# Altium project radxa_cm3i_io_board_v1.4.PrjPcb (part 3 of 4)

## Sheet 16.SchDoc
size 420 x 297 mm
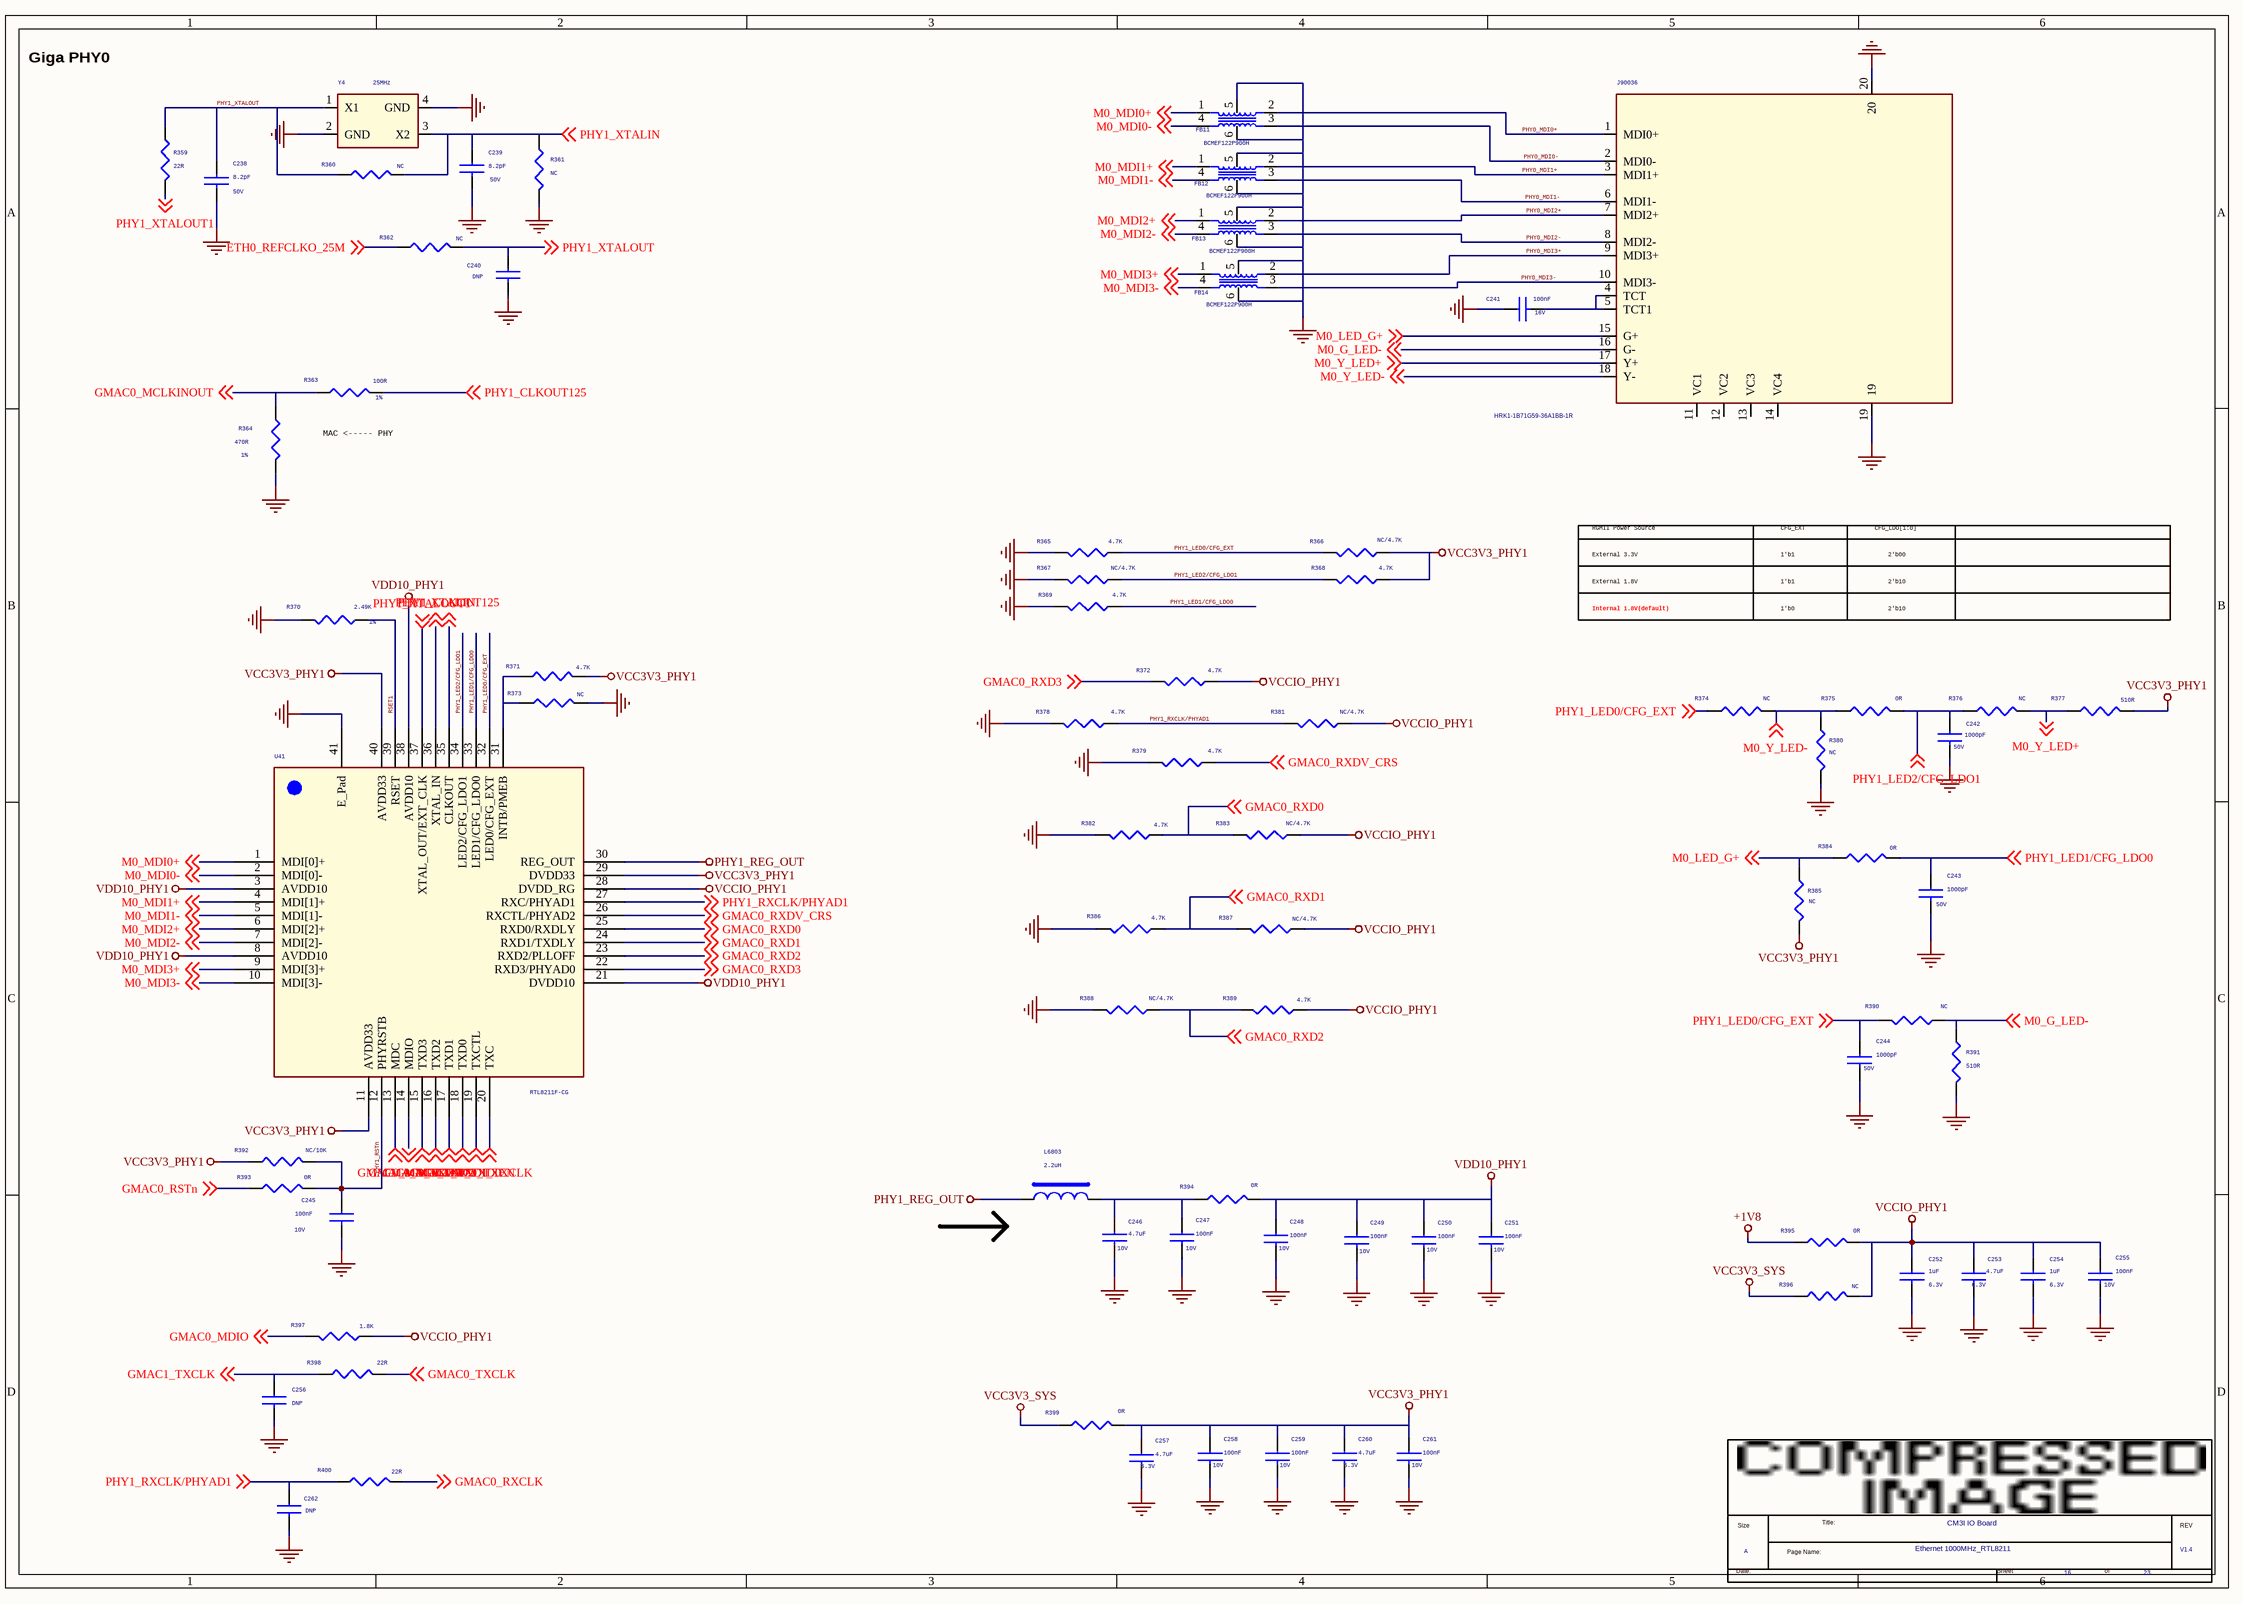
[diagram p14: 16.SchDoc]

### Parts
(Parts that share a designator on the sheet are numbered #1, #2 ... from top to bottom, then left to right.)
*#15  Page Count: 23  Page Number: 16  Page Size: A  Title: CM3I IO Board  RevCode: V1.4  Doc: Ethernet 1000MHz_RTL8211  (hidden comment: radxa_1010)  (graphical)
C238  8.2pF  Voltage: 50V  [C0402]
C239  8.2pF  Voltage: 50V  [C0402]
C240  DNP  [C0402]
C241  100nF  Voltage: 16V  [C0402]
C242  1000pF  Voltage: 50V  [C0402]
C243  1000pF  Voltage: 50V  [C0402]
C244  1000pF  Voltage: 50V  [C0402]
C245  100nF  Voltage: 10V  [C0402]
C246  4.7uF  Voltage: 10V  [C0603]
C247  100nF  Voltage: 10V  [C0402]
C248  100nF  Voltage: 10V  [C0402]
C249  100nF  Voltage: 10V  [C0402]
C250  100nF  Voltage: 10V  [C0402]
C251  100nF  Voltage: 10V  [C0402]
C252  1uF  Voltage: 6.3V  [C0402]
C253  4.7uF  Voltage: 6.3V  [C0402]
C254  1uF  Voltage: 6.3V  [C0402]
C255  100nF  Voltage: 10V  [C0402]
C256  DNP  [C0402]
C257  4.7uF  Voltage: 6.3V  [C0402]
C258  100nF  Voltage: 10V  [C0402]
C259  100nF  Voltage: 10V  [C0402]
C260  4.7uF  Voltage: 6.3V  [C0402]
C261  100nF  Voltage: 10V  [C0402]
C262  DNP  [C0402]
FB11  BCMEF122P900H  [GMDG-6PIN_ESD]
FB12  BCMEF122P900H  [GMDG-6PIN_ESD]
FB13  BCMEF122P900H  [GMDG-6PIN_ESD]
FB14  BCMEF122P900H  [GMDG-6PIN_ESD]
J90036  HRK1-1B71G59-36A1BB-1R  [RJ45_PULSE]
L6803  2.2uH  [IND_252010]
R359  22R  [R0402]
R360  NC  [R0402]
R361  NC  [R0402]
R362  NC  [R0402]
R363  100R  Tolerance: 1%  [R0402]
R364  470R  Tolerance: 1%  [R0402]
R365  4.7K  [R0402]
R366  NC/4.7K  [R0402]
R367  NC/4.7K  [R0402]
R368  4.7K  [R0402]
R369  4.7K  [R0402]
R370  2.49K  Tolerance: 1%  [R0402]
R371  4.7K  [R0402]
R372  4.7K  [R0402]
R373  NC  [R0402]
R374  NC  [R0402]
R375  0R  [R0402]
R376  NC  [R0402]
R377  510R  [R0402]
R378  4.7K  [R0402]
R379  4.7K  [R0402]
R380  NC  [R0402]
R381  NC/4.7K  [R0402]
R382  4.7K  [R0402]
R383  NC/4.7K  [R0402]
R384  0R  [R0402]
R385  NC  [R0402]
R386  4.7K  [R0402]
R387  NC/4.7K  [R0402]
R388  NC/4.7K  [R0402]
R389  4.7K  [R0402]
R390  NC  [R0402]
R391  510R  [R0402]
R392  NC/10K  [R0402]
R393  0R  [R0402]
R394  0R  [R0402]
R395  0R  [R0402]
R396  NC  [R0402]
R397  1.8K  [R0402]
R398  22R  [R0402]
R399  0R  [R0402]
R400  22R  [R0402]
U41  RTL8211F-CG  [QFN40_5R00X5R00X0R80_T]
Y4  25MHz  [CRY-3225]

### Nets
+1V8: R395.1
GND: C238.2 C239.2 C240.2 C241.1 C242.2 C243.2 C244.2 C245.2 C246.2 C247.2 C248.2 C249.2 C250.2 C251.2 C252.2 C253.2 C254.2 C255.2 C256.2 C257.2 C258.2 C259.2 C260.2 C261.2 C262.2 FB11.5 FB11.6 FB12.5 FB12.6 FB13.5 FB13.6 FB14.5 FB14.6 J90036.19 J90036.20 R361.2 R364.2 R365.2 R367.2 R369.2 R370.2 R373.2 R378.2 R379.2 R380.2 R382.2 R386.2 R388.2 R391.2 U41.41(E_Pad) Y4.2(GND) Y4.4(GND)
PHY1_REG_OUT: L6803.1 U41.30(REG_OUT)
VCC3V3_PHY1: C257.1 C258.1 C259.1 C260.1 C261.1 R366.1 R368.1 R371.2 R377.2 R385.2 R392.1 R399.2 U41.11(AVDD33) U41.29(DVDD33) U41.40(AVDD33)
VCC3V3_SYS: R396.1 R399.1
VCCIO_PHY1: C252.1 C253.1 C254.1 C255.1 R372.1 R381.1 R383.1 R387.1 R389.1 R395.2 R396.2 R397.1 U41.28(DVDD_RG)
VDD10_PHY1: C248.1 C249.1 C250.1 C251.1 R394.2 U41.3(AVDD10) U41.8(AVDD10) U41.21(DVDD10) U41.38(AVDD10)
ETH0_REFCLKO_25M: R362.1 ; off-sheet ETH0_REFCLKO_25M
GMAC0_MCLKINOUT: R363.1 R364.1 ; off-sheet GMAC0_MCLKINOUT
GMAC0_MDC: U41.13(MDC) ; off-sheet GMAC0_MDC
GMAC0_MDIO: R397.2 U41.14(MDIO) ; off-sheet GMAC0_MDIO
GMAC0_RSTn: R393.1 ; off-sheet GMAC0_RSTn
GMAC0_RXCLK: R400.2 ; off-sheet GMAC0_RXCLK
GMAC0_RXD0: R382.1 R383.2 U41.25(RXD0/RXDLY) ; off-sheet GMAC0_RXD0
GMAC0_RXD1: R386.1 R387.2 U41.24(RXD1/TXDLY) ; off-sheet GMAC0_RXD1
GMAC0_RXD2: R388.1 R389.2 U41.23(RXD2/PLLOFF) ; off-sheet GMAC0_RXD2
GMAC0_RXD3: R372.2 U41.22(RXD3/PHYAD0) ; off-sheet GMAC0_RXD3
GMAC0_RXDV_CRS: R379.1 U41.26(RXCTL/PHYAD2) ; off-sheet GMAC0_RXDV_CRS
GMAC0_TXCLK: R398.2 ; off-sheet GMAC0_TXCLK
GMAC0_TXD0: U41.18(TXD0) ; off-sheet GMAC0_TXD0
GMAC0_TXD1: U41.17(TXD1) ; off-sheet GMAC0_TXD1
GMAC0_TXD2: U41.16(TXD2) ; off-sheet GMAC0_TXD2
GMAC0_TXD3: U41.15(TXD3) ; off-sheet GMAC0_TXD3
GMAC0_TXEN: U41.19(TXCTL) ; off-sheet GMAC0_TXEN
GMAC1_TXCLK: C256.1 R398.1 U41.20(TXC) ; off-sheet GMAC1_TXCLK
M0_G_LED-: J90036.16(G-) R390.1 R391.1 ; off-sheet M0_G_LED-
M0_LED_G+: J90036.15(G+) R384.1 R385.1 ; off-sheet M0_LED_G+
M0_MDI0+: FB11.1(R1) U41.1(MDI[0]+) ; off-sheet M0_MDI0+
M0_MDI0-: FB11.4(R2) U41.2(MDI[0]-) ; off-sheet M0_MDI0-
M0_MDI1+: FB12.1(R1) U41.4(MDI[1]+) ; off-sheet M0_MDI1+
M0_MDI1-: FB12.4(R2) U41.5(MDI[1]-) ; off-sheet M0_MDI1-
M0_MDI2+: FB13.1(R1) U41.6(MDI[2]+) ; off-sheet M0_MDI2+
M0_MDI2-: FB13.4(R2) U41.7(MDI[2]-) ; off-sheet M0_MDI2-
M0_MDI3+: FB14.1(R1) U41.9(MDI[3]+) ; off-sheet M0_MDI3+
M0_MDI3-: FB14.4(R2) U41.10(MDI[3]-) ; off-sheet M0_MDI3-
M0_Y_LED+: J90036.17(Y+) R376.2 R377.1 ; off-sheet M0_Y_LED+
M0_Y_LED-: J90036.18(Y-) R374.1 R375.1 R380.1 ; off-sheet M0_Y_LED-
PHY0_MDI0+: FB11.2(R4) J90036.1(MDI0+)
PHY0_MDI0-: FB11.3(R3) J90036.2(MDI0-)
PHY0_MDI1+: FB12.2(R4) J90036.3(MDI1+)
PHY0_MDI1-: FB12.3(R3) J90036.6(MDI1-)
PHY0_MDI2+: FB13.2(R4) J90036.7(MDI2+)
PHY0_MDI2-: FB13.3(R3) J90036.8(MDI2-)
PHY0_MDI3+: FB14.2(R4) J90036.9(MDI3+)
PHY0_MDI3-: FB14.3(R3) J90036.10(MDI3-)
PHY1_CLKOUT125: R363.2 U41.35(CLKOUT) ; off-sheet PHY1_CLKOUT125
PHY1_LED0/CFG_EXT: C244.1 R365.1 R366.2 R374.2 R390.2 U41.32(LED0/CFG_EXT) ; off-sheet PHY1_LED0/CFG_EXT
PHY1_LED1/CFG_LDO0: C243.1 R369.1 R384.2 U41.33(LED1/CFG_LDO0) ; off-sheet PHY1_LED1/CFG_LDO0
PHY1_LED2/CFG_LDO1: C242.1 R367.1 R368.2 R375.2 R376.1 U41.34(LED2/CFG_LDO1) ; off-sheet PHY1_LED2/CFG_LDO1
PHY1_RSTn: C245.1 R392.2 R393.2 U41.12(PHYRSTB)
PHY1_RXCLK/PHYAD1: C262.1 R378.1 R381.2 R400.1 U41.27(RXC/PHYAD1) ; off-sheet PHY1_RXCLK/PHYAD1
PHY1_XTALIN: C239.1 R360.2 R361.1 U41.36(XTAL_IN) Y4.3(X2) ; off-sheet PHY1_XTALIN
PHY1_XTALOUT: C238.1 C240.1 R359.1 R360.1 R362.2 Y4.1(X1) ; off-sheet PHY1_XTALOUT
PHY1_XTALOUT1: R359.2 U41.37(XTAL_OUT/EXT_CLK) ; off-sheet PHY1_XTALOUT1
RSET1: R370.1 U41.39(RSET)
NetC241_2: C241.2 J90036.4(TCT) J90036.5(TCT1)
NetC246_1: C246.1 C247.1 L6803.2 R394.1
NetR371_1: R371.1 R373.1 U41.31(INTB/PMEB)

Not connected (* = marked no-connect by the designer): J90036 11(VC1) 12(VC2) 13(VC3) 14(VC4)

### Notes on the sheet
- Giga PHY0
- MAC <----- PHY
- RGMII Power Source
- CFG_EXT
- CFG_LDO[1:0]
- External 3.3V
- External 1.8V
- 1'b1
- 2'b00
- 2'b10
- Internal 1.8V(default)
- 1'b0
- (in symbol radxa_1010) Size; Title:; REV; Page Name:; Date:; Sheet; of

### Library data of the parts
C238 C239 = CAP NP_0_Dup4: cap,18.00pF,+/-5%,50V,C0G,C0402; Manufacturer PN: C1005C0G1H180J050BA; Manufacturer: TDK; Tolerance: 5%; Priority: A; Dielectric: C0G; Created by: JJJ; Part Type: C0402; RK PN: C1005C0G1H180J050BA
C240 C256 = CAP NP_0_Dup4: Did Not Place.; Number: 37; RK PN: DNPC0402; Priority: A; C_Voltage: 6.3V; Part Type: DNP; Manufacturer PN: DNPC0402; Created by: JJJ
C241 = CAP NP_0_Dup4: cap,100.00nF,+/-10%,16V,X5R,C0402; Manufacturer: TDK; RK PN: C1005X5R1C104K050BA; Priority: A; Tolerance: 10%; Dielectric: X5R; Part Type: C0402; Manufacturer PN: C1005X5R1C104K050BA; Created by: JJJ
C242-C244 = CAP NP_0_Dup4: cap,100.00pF,+/-10%,50V,C0G,C0402; Manufacturer: TDK; Number: 37; RK PN: C1005C0G1H101K050BA; Priority: A; Tolerance: 10%; C_Voltage: 6.3V; option: DNP; Dielectric: C0G; Part Type: C0402; Manufacturer PN: C1005C0G1H101K050BA; Created by: JJJ
C245 = CAP NP_0_Dup4: cap,100.00nF,+/-10%,10V,X5R,C0402; Manufacturer PN: C1005X5R1A104K050BA; Manufacturer: TDK; Tolerance: 10%; Priority: A; Dielectric: X5R; Created by: JJJ; Part Type: C0402; RK PN: C1005X5R1A104K050BA
C246 = CAP NP_0_Dup4: cap,4.70uF,+/-10%,10V,X5R,C0603; Manufacturer: TDK; RK PN: C1608X5R1A475K080AC; Priority: A; C_Voltage: 6.3V; Tolerance: 10%; Dielectric: X5R; Part Type: C0603; Manufacturer PN: C1608X5R1A475K080AC; Created by: JJJ
C247 C249-C251 C255 C258 C259 C261 = CAP NP_0_Dup4: cap,100.00nF,+/-10%,10V,X5R,C0402; Manufacturer PN: C1005X5R1A104K050BA; Manufacturer: TDK; C_Voltage: 6.3V; Tolerance: 10%; Priority: A; Number: 37; Dielectric: X5R; Created by: JJJ; Part Type: C0402; RK PN: C1005X5R1A104K050BA
C248 = CAP NP_0_Dup4: cap,100.00nF,+/-10%,10V,X5R,C0402; Manufacturer: TDK; Number: 37; RK PN: C1005X5R1A104K050BA; Priority: A; Tolerance: 10%; C_Voltage: 6.3V; Dielectric: X5R; Part Type: C0402; Manufacturer PN: C1005X5R1A104K050BA; Created by: JJJ
C252 C254 = CAP NP_0_Dup4: cap,1.00uF,+/-10%,6.3V,X5R,C0402; Manufacturer PN: C1005X5R0J105K050BB; Manufacturer: TDK; Tolerance: 10%; Priority: A; Dielectric: X5R; Created by: JJJ; C_Voltage: 6.3V; Part Type: C0402; RK PN: C1005X5R0J105K050BB
C253 C257 = CAP NP_0_Dup4: cap,4.70uF,+/-10%,6.3V,X5R,C0402; Manufacturer PN: C1005X5R0J475K050BC; Manufacturer: TDK; Tolerance: 10%; Priority: A; Dielectric: X5R; Created by: JJJ; C_Voltage: 6.3V; Part Type: C0402; RK PN: C1005X5R0J475K050BC
C260 = CAP NP_0_Dup4: cap,4.70uF,+/-10%,6.3V,X5R,C0402; Manufacturer: TDK; RK PN: C1005X5R0J475K050BC; Priority: A; Tolerance: 10%; Dielectric: X5R; Part Type: C0402; C_Voltage: 6.3V; Manufacturer PN: C1005X5R0J475K050BC; Created by: JJJ
C262 = CAP NP_0_Dup4: Did Not Place.; Manufacturer PN: DNPC0402; C_Voltage: 6.3V; Priority: A; Number: 37; Created by: JJJ; Part Type: DNP; RK PN: DNPC0402
FB11-FB14 = R-PACK4_0_Dup1
J90036 = HR911130C_1: 千兆网口接口，内置变压器; VAL: J00-0061; DESIG: 10/100 base TX LXT971A; BOI: RJ45; FAB: PULSE; DEV: CON_PULSE_J00-61; Priority: A; REF: J00-0061; RK PN: HR911130C; Part Type: Ethernet Jack; Manufacturer Part Number: HR911130C; Created by: JJJ
L6803 = INDUCTORS OF FERRITE_Dup1: Power Inductor,2.2uH,0.3,IND_303015; Manufacturer: sunlord; DC Resistor: 0.06ohm; Isat: 1.6A; RK PN: SWPA3015S2R2NT; Priority: A; Tolerance: 30%; Resonace frequency: 86M; Part Type: POWER_IND; Irms: 1.6A; Manufacturer PN: SWPA3015S2R2NT; Created by: YTL
R359 R361 = RESISTOR_0_Dup5: 通用厚膜电阻,0R,+/-5%,R0402,1/16W.; Manufacturer PN: RC0402JR-070RL; Manufacturer: YAGEO; Tolerance: 5%; option: DNP; Wattage: 1/16W; Priority: A; Created by: YTL; Part Type: 通用厚膜电阻; RK PN: RC0402JR-070RL
R360 = RESISTOR_0_Dup5: 通用厚膜电阻,0R,+/-5%,R0402,1/16W.; Manufacturer PN: RC0402JR-070RL; Manufacturer: YAGEO; Tolerance: 5%; Wattage: 1/16W; Priority: A; Option: DNP; Created by: YTL; Part Type: 通用厚膜电阻; RK PN: RC0402JR-070RL
R362 = RESISTOR_0_Dup5: 通用厚膜电阻,0R,+/-5%,R0402,1/16W.; Manufacturer: YAGEO; Tolerance: 5%; Option: DNP; RK PN: RC0402JR-070RL; Priority: A; Wattage: 1/16W; Part Type: 通用厚膜电阻; Manufacturer PN: RC0402JR-070RL; Created by: YTL
R363 = RESISTOR_0_Dup5: 通用厚膜电阻,100R,+/-5%,R0402,1/16W.; Manufacturer: YAGEO; RK PN: RC0402JR-07100RL; Priority: A; Wattage: 1/16W; Part Type: 通用厚膜电阻; Manufacturer PN: RC0402JR-07100RL; Created by: YTL
R364 = RESISTOR_0_Dup5: 通用厚膜电阻,120R,+/-5%,R0402,1/16W.; Manufacturer PN: RC0402JR-07120RL; Manufacturer: YAGEO; Wattage: 1/16W; Priority: A; Created by: YTL; Part Type: 通用厚膜电阻; RK PN: RC0402JR-07120RL
R365 R379 = RESISTOR_0_Dup5: 通用厚膜电阻,4K7,+/-5%,R0402,1/16W.; Manufacturer PN: RC0402JR-074K7L; Manufacturer: YAGEO; Tolerance: 5%; Wattage: 1/16W; Priority: A; Created by: YTL; Part Type: 通用厚膜电阻; RK PN: RC0402JR-074K7L
R366 = RESISTOR_0_Dup5: 通用厚膜电阻,4K7,+/-5%,R0402,1/16W.; Manufacturer PN: RC0402JR-074K7L; Manufacturer: YAGEO; Tolerance: 5%; Wattage: 1/16W; Priority: A; option: DNP; Created by: YTL; Part Type: 通用厚膜电阻; RK PN: RC0402JR-074K7L
R367 R381 R387 R388 = RESISTOR_0_Dup5: 通用厚膜电阻,4K7,+/-5%,R0402,1/16W.; Manufacturer: YAGEO; Tolerance: 5%; RK PN: RC0402JR-074K7L; Priority: A; Wattage: 1/16W; option: DNP; Part Type: 通用厚膜电阻; Manufacturer PN: RC0402JR-074K7L; Created by: YTL
R368 R369 R372 R378 R382 R386 R389 = RESISTOR_0_Dup5: 通用厚膜电阻,4K7,+/-5%,R0402,1/16W.; Manufacturer: YAGEO; Tolerance: 5%; RK PN: RC0402JR-074K7L; Priority: A; Wattage: 1/16W; Part Type: 通用厚膜电阻; Manufacturer PN: RC0402JR-074K7L; Created by: YTL
R370 = RESISTOR_0_Dup5: 通用厚膜电阻,2K49,+/-1%,R0402,1/16W.; Manufacturer PN: RC0402FR-072K49L; Manufacturer: YAGEO; Wattage: 1/16W; Priority: A; Created by: YTL; Part Type: 通用厚膜电阻; RK PN: RC0402FR-072K49L
R371 R374 R380 R393 = RESISTOR_0_Dup5: 通用厚膜电阻,0R,+/-5%,R0402,1/16W.; Manufacturer: YAGEO; Tolerance: 5%; RK PN: RC0402JR-070RL; Priority: A; Wattage: 1/16W; Part Type: 通用厚膜电阻; Manufacturer PN: RC0402JR-070RL; Created by: YTL
R373 R375 R399 = RESISTOR_0_Dup5: 通用厚膜电阻,0R,+/-5%,R0402,1/16W.; Manufacturer PN: RC0402JR-070RL; Manufacturer: YAGEO; Tolerance: 5%; Wattage: 1/16W; Priority: A; Created by: YTL; Part Type: 通用厚膜电阻; RK PN: RC0402JR-070RL
R376 = RESISTOR_0_Dup5: 通用厚膜电阻,0R,+/-5%,R0402,1/16W.; Manufacturer: YAGEO; Tolerance: 5%; RK PN: RC0402JR-070RL; Priority: A; Wattage: 1/16W; option: DNP; Part Type: 通用厚膜电阻; Manufacturer PN: RC0402JR-070RL; Created by: YTL
R377 R390 R391 = RESISTOR_0_Dup5: 通用厚膜电阻,510R,+/-5%,R0402,1/16W.; Manufacturer: YAGEO; Tolerance: 5%; RK PN: RC0402JR-07510RL; Priority: A; Wattage: 1/16W; Part Type: 通用厚膜电阻; Manufacturer PN: RC0402JR-07510RL; Created by: YTL
R383 = RESISTOR_0_Dup5: 通用厚膜电阻,4K7,+/-5%,R0402,1/16W.; Manufacturer PN: RC0402JR-074K7L; Manufacturer: YAGEO; Tolerance: 5%; option: DNP; Wattage: 1/16W; Priority: A; Created by: YTL; Part Type: 通用厚膜电阻; RK PN: RC0402JR-074K7L
R384 = RESISTOR_0_Dup5: 通用厚膜电阻,120R,+/-5%,R0402,1/16W.; Manufacturer PN: RC0402JR-07120RL; Manufacturer: YAGEO; Tolerance: 5%; Wattage: 1/16W; Priority: A; Created by: YTL; Part Type: 通用厚膜电阻; RK PN: RC0402JR-07120RL
R385 = RESISTOR_0_Dup5: 通用厚膜电阻,510R,+/-5%,R0402,1/16W.; Manufacturer PN: RC0402JR-07510RL; Manufacturer: YAGEO; Tolerance: 5%; Wattage: 1/16W; Priority: A; Created by: YTL; Part Type: 通用厚膜电阻; RK PN: RC0402JR-07510RL
R392 = RESISTOR_0_Dup5: 通用厚膜电阻,10K,+/-5%,R0402,1/16W.; Manufacturer: YAGEO; Tolerance: 5%; RK PN: RC0402JR-0710KL; Priority: A; Wattage: 1/16W; Option: DNP; Part Type: 通用厚膜电阻; Manufacturer PN: RC0402JR-0710KL; Created by: YTL
R394 = RESISTOR_0_Dup5: 通用厚膜电阻,0R,+/-5%,R0402,1/16W.; Manufacturer PN: RC0402JR-070RL; Manufacturer: YAGEO; Tolerance: 5%; Wattage: 1/16W; Priority: A; option: DNP; Created by: YTL; Part Type: 通用厚膜电阻; RK PN: RC0402JR-070RL
R395 R396 = RESISTOR_0_Dup5: 通用厚膜电阻,0R,+/-5%,R0402,1/16W.; Manufacturer: YAGEO; Tolerance: 5%; option: DNP; RK PN: RC0402JR-070RL; Priority: A; Wattage: 1/16W; Part Type: 通用厚膜电阻; Manufacturer PN: RC0402JR-070RL; Created by: YTL
R397 = RESISTOR_0_Dup5: 通用厚膜电阻,1K8,+/-5%,R0402,1/16W.; Manufacturer PN: RC0402JR-071K8L; Manufacturer: YAGEO; Tolerance: 5%; Wattage: 1/16W; Priority: A; Created by: YTL; Part Type: 通用厚膜电阻; RK PN: RC0402JR-071K8L
R398 R400 = RESISTOR_0_Dup5: 通用厚膜电阻,22R,+/-5%,R0402,1/16W.; Manufacturer: YAGEO; Tolerance: 5%; RK PN: RC0402JR-0722RL; Priority: A; Wattage: 1/16W; Part Type: 通用厚膜电阻; Manufacturer PN: RC0402JR-0722RL; Created by: YTL
U41 = Ethernet_RTL8211F: Integrated 10/100/1000 Gigabit Ethernet Transceiver，Supports IEEE 802.3az-2010,; Manufacturer: RealTek(瑞昱); Priority: A; Created by: JJJ; Manufacturer PN: RTL8211F-CG; Part Type: Ethernet; RK PN: RTL8211F-CG
Y4 = CRYSTAL_4P: 无源晶振，25M，3225,±10ppm，10pF，Hosonic; Manufacturer PN: E3SB25.0000F10E11; Manufacturer: Hosonic(鸿星电子); Priority: A; Created by: JJJ; Part Type: CRYSTAL; RK PN: E3SB25.0000F10E11
*#15 = radxa_1010: Page Create Date: March  8, 1995

## Sheet 17.SchDoc
size 297 x 209 mm
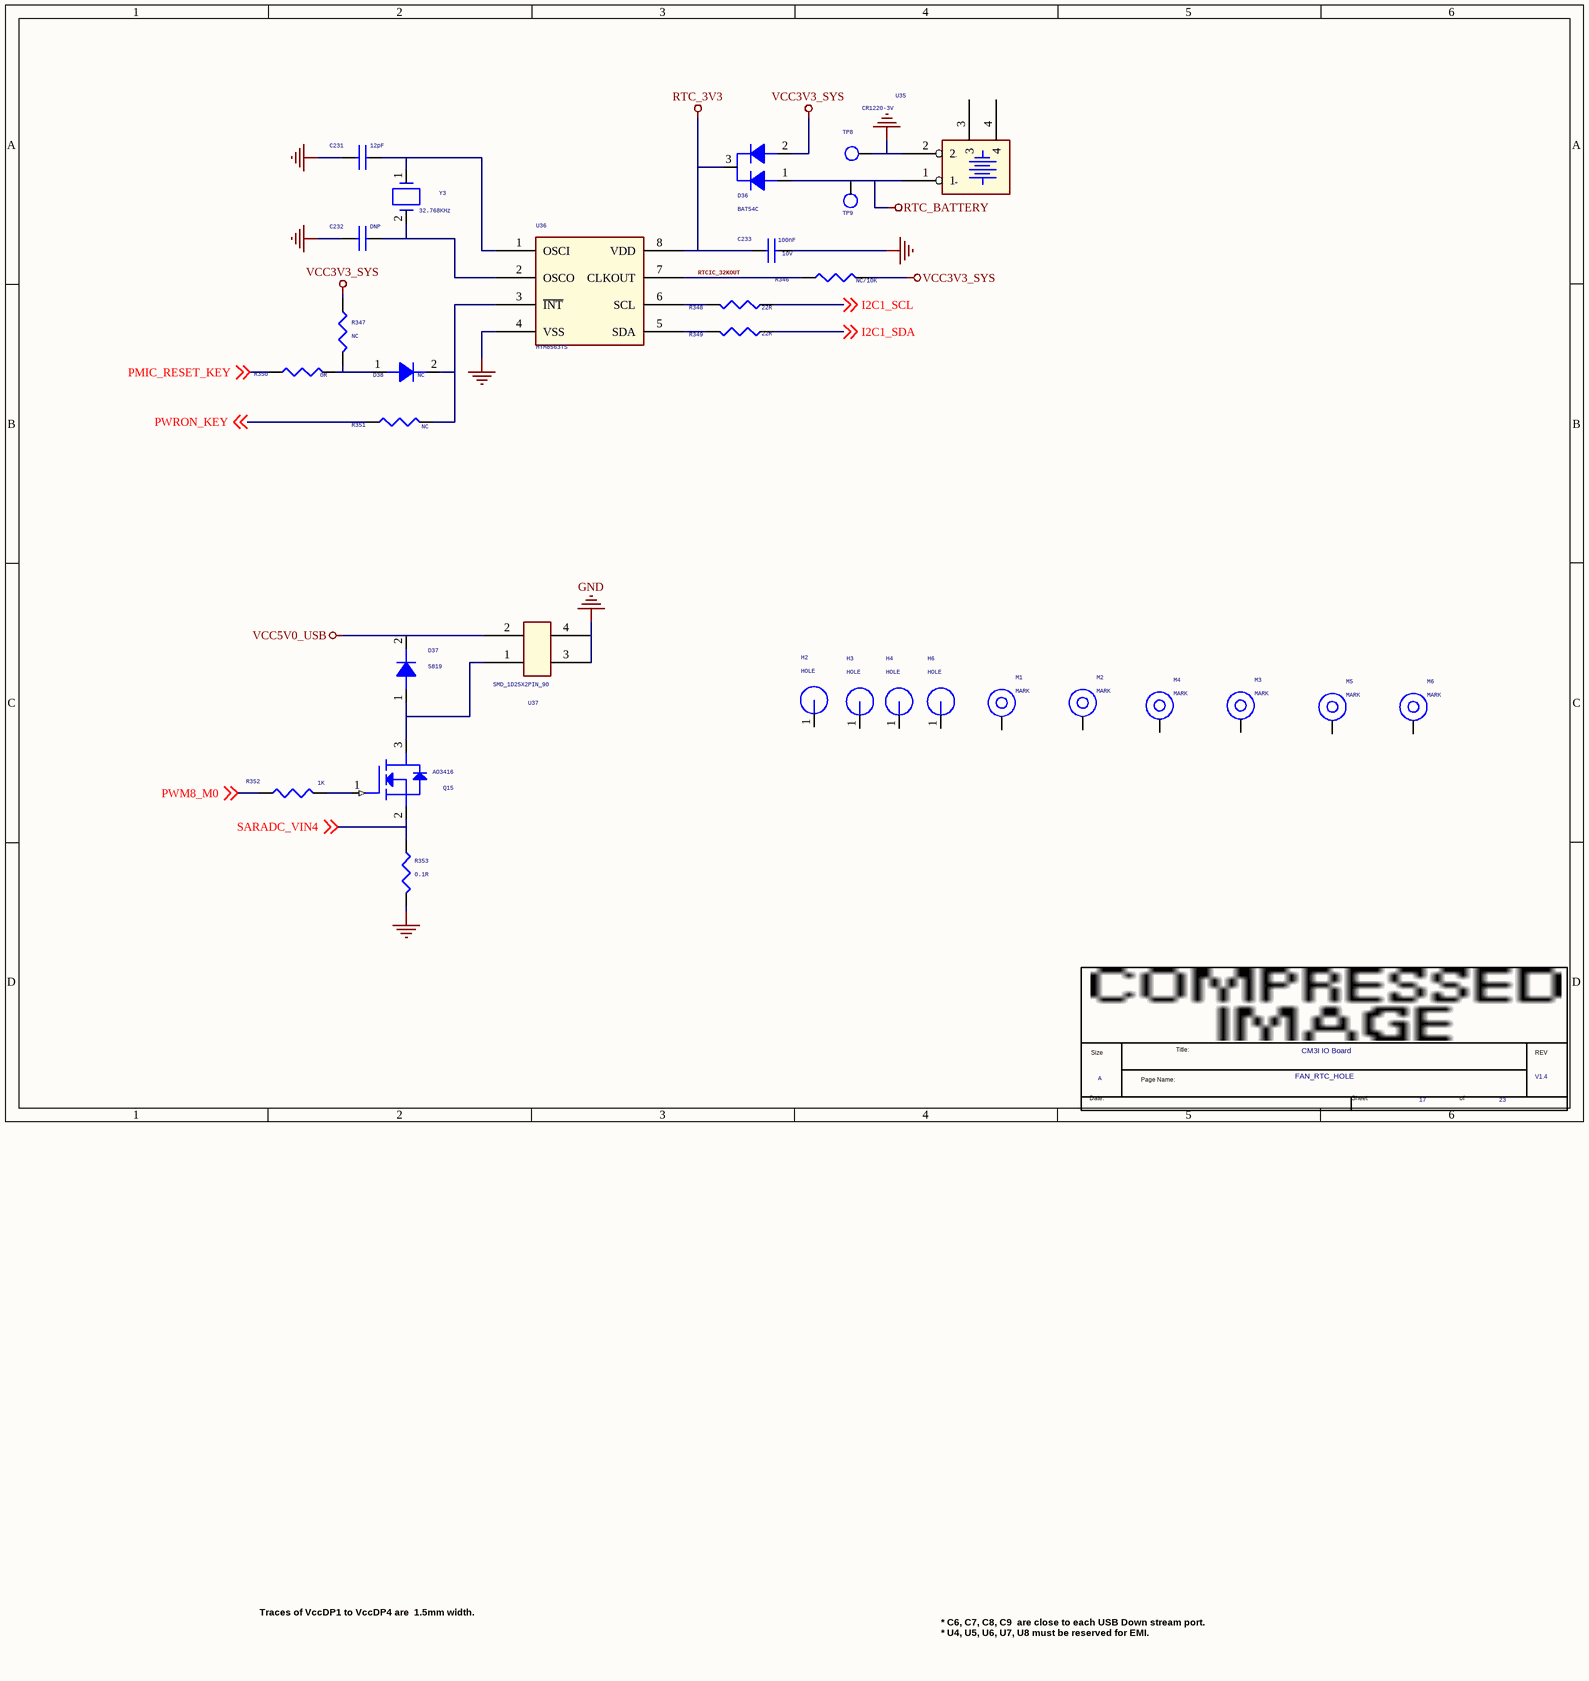
[diagram p15: 17.SchDoc]

### Parts
(Parts that share a designator on the sheet are numbered #1, #2 ... from top to bottom, then left to right.)
*#16  Page Count: 23  Page Number: 17  Page Size: A  Title: CM3I IO Board  RevCode: V1.4  Doc: FAN_RTC_HOLE  (hidden comment: radxa_1010)  (graphical)
C231  12pF  [C0402]
C232  DNP  [C0402]
C233  100nF  Voltage: 10V  [C0402]
D36  BAT54C  [SOT_23]
D37  5819  [SOD_123]
D38  NC  [SOD323]
H2  HOLE  [H3.8MM]
H3  HOLE  [H3.8MM]
H4  HOLE  [H3.8MM]
H6  HOLE  [H3.8MM]
M1  MARK  [MARK]
M2  MARK  [MARK]
M3  MARK  [MARK]
M4  MARK  [MARK]
M5  MARK  [MARK]
M6  MARK  [MARK]
Q15  AO3416  [SOT23]
R346  NC/10K  [R0402]
R347  NC  [R0402]
R348  22R  [R0402]
R349  22R  [R0402]
R350  0R  [R0402]
R351  NC  [R0402]
R352  1K  [R0402]
R353  0.1R  [R0402]
TP8  TP_0.7  [TEST]  (value not drawn)
TP9  TP_0.7  [TEST]  (value not drawn)
U35  CR1220-3V  [BATTERY-20MM]
U36  HYM8563TS  [MSOP8]
U37  SMD_1D25X2PIN_90  [SMD_1D25X2PIN_90]
Y3  32.768KHz  [CRY-3215]

### Nets
GND: C231.2 C232.2 C233.2 R353.2 TP8.1 U35.2 U36.4(VSS) U37.3 U37.4
RTC_3V3: C233.1 D36.3(K) U36.8(VDD)
RTC_BATTERY: D36.1(A1) TP9.1 U35.1
VCC3V3_SYS: D36.2(A2) R346.2 R347.1
VCC5V0_USB: D37.2(K) U37.2
I2C1_SCL: R348.1 ; off-sheet I2C1_SCL
I2C1_SDA: R349.1 ; off-sheet I2C1_SDA
PMIC_RESET_KEY: R350.1 ; off-sheet PMIC_RESET_KEY
PWM8_M0: R352.1 ; off-sheet PWM8_M0
PWRON_KEY: R351.1 ; off-sheet PWRON_KEY
RTCIC_32KOUT: R346.1 U36.7(CLKOUT)
SARADC_VIN4: Q15.2(SOURCE) R353.1 ; off-sheet SARADC_VIN4
NetC231_1: C231.1 U36.1(OSCI) Y3.1
NetC232_1: C232.1 U36.2(OSCO) Y3.2
NetD37_1: D37.1(A) Q15.3(DRAIN) U37.1
NetD38_1: D38.1(A) R347.2 R350.2
NetD38_2: D38.2(K) R351.2 U36.3(~{INT})
NetQ15_1: Q15.1(GATE) R352.2
NetR348_2: R348.2 U36.6(SCL)
NetR349_2: R349.2 U36.5(SDA)

Not connected (* = marked no-connect by the designer): H2 1; H3 1; H4 1; H6 1; M1 1; M2 1; M3 1; M4 1; M5 1; M6 1; U35 3 4

### Notes on the sheet
- Traces of VccDP1 to VccDP4 are  1.5mm width.
- * C6, C7, C8, C9  are close to each USB Down stream port.
  * U4, U5, U6, U7, U8 must be reserved for EMI.
- (in symbol CON_BATTERY-20MM_0) -; +
- (in symbol radxa_1010) Title:; Size; REV; Page Name:; Date:; Sheet; of

### Library data of the parts
C231 = CAP NP_0: cap,12.00pF,+/-5%,50V,C0G,C0402; Manufacturer PN: C1005C0G1H120J050BA; Manufacturer: TDK; Tolerance: 5%; Priority: A; Voltage: 50V; Dielectric: C0G; Created by: JJJ; Part Type: C0402; RK PN: C1005C0G1H120J050BA
C232 = CAP NP_0: Did Not Place.; Manufacturer PN: DNPC0402; Priority: A; Created by: JJJ; Part Type: DNP; RK PN: DNPC0402
C233 = CAP NP_0: cap,100.00nF,+/-10%,10V,X5R,C0402; Manufacturer: TDK; Number: 37; RK PN: C1005X5R1A104K050BA; Priority: A; Tolerance: 10%; C_Voltage: 6.3V; Dielectric: X5R; Part Type: C0402; Manufacturer PN: C1005X5R1A104K050BA; Created by: JJJ
D36 = DIODE Double: Dual Schottky barrier，BAT54C SOT-23 Schottky Barrier; Manufacturer: 长电; Priority: A; Created by: JJJ; Manufacturer PN: BAT54C; Part Type: Schottky rectifier; RK PN: BAT54C
D37 D38 = DIODE_Dup2: Schottky Barrier，B5819WS SOD-323; Manufacturer: 长电; Priority: A; Created by: JJJ; Manufacturer PN: B5819WS; Part Type: Schottky rectifier; RK PN: B5819WS
H2 H3 H6 = HOLE: 直径3.5mm hole; Priority: A; RK PN: HOLE_3R50; Created by: CZD; Part Type: HOLE
H4 = HOLE: 直径3.5mm hole; RK PN: HOLE_3R50; Priority: A; Part Type: HOLE; Created by: CZD
M1 M3 = MARK: MARK Symble; Priority: A; RK PN: MARK01; Created by: JJJ; Part Type: MARK
M2 M4-M6 = MARK: MARK Symble; RK PN: MARK01; Priority: A; Part Type: MARK; Created by: JJJ
Q15 = MOSFET N_Dup1: MOSFET-N,WNM3003 ,30V,+/-20V,4.0A,33m Ohm@Vgs=10V,43m Ohm@Vgs=4.5V,SOT23
R346 R347 R350 = RESISTOR_0_Dup1: 通用厚膜电阻,10K,+/-5%,R0402,1/16W.; Manufacturer PN: RC0402JR-0710KL; Manufacturer: YAGEO; Tolerance: 5%; option: DNP; Wattage: 1/16W; Priority: A; Created by: YTL; Part Type: 通用厚膜电阻; RK PN: RC0402JR-0710KL
R348 = RESISTOR_0_Dup1: 通用厚膜电阻,47K,+/-5%,R0402,1/16W.; Manufacturer: YAGEO; Tolerance: 5%; RK PN: RC0402JR-0747KL; Priority: A; Wattage: 1/16W; Part Type: 通用厚膜电阻; Manufacturer PN: RC0402JR-0747KL; Created by: YTL
R349 = RESISTOR_0_Dup1: 通用厚膜电阻,47K,+/-5%,R0402,1/16W.; Manufacturer PN: RC0402JR-0747KL; Manufacturer: YAGEO; Tolerance: 5%; Wattage: 1/16W; Priority: A; Created by: YTL; Part Type: 通用厚膜电阻; RK PN: RC0402JR-0747KL
R351 = RESISTOR_0_Dup1: 通用厚膜电阻,10K,+/-5%,R0402,1/16W.; Manufacturer: YAGEO; Tolerance: 5%; RK PN: RC0402JR-0710KL; Priority: A; Wattage: 1/16W; option: DNP; Part Type: 通用厚膜电阻; Manufacturer PN: RC0402JR-0710KL; Created by: YTL
R352 = RESISTOR_0_Dup1: as R301 on sheet 11; Part Type: 通用厚膜电阻; Manufacturer PN: RC0402JR-07100KL; Created by: YTL
R353 = RESISTOR_0_Dup1: as R291 on sheet 11; Created by: YTL; Part Type: 通用厚膜电阻; RK PN: RC0402JR-0710KL
TP8 = TP: Test Point 0.7mm; RK PN: TESTPOINT_0R7; Priority: A; Part Type: TP; Created by: JJJ
TP9 = TP: Test Point 0.7mm; Priority: A; RK PN: TESTPOINT_0R7; Created by: JJJ; Part Type: TP
U35 = CON_BATTERY-20MM_0
U36 = RTC_HYM8563: I2C Real Time Clock/Calendar; Manufacturer: Haoyu（昊昱微电子）; Priority: A; Created by: JJJ; Manufacturer PN: HYM8563TS; Part Type: RTC; RK PN: HYM8563TS
U37 = CON3_6
Y3 = CRYSTAL_2P_0: 无源晶振，32.768KHz，MC-146,±20ppm，12.5pF，Hosonic; Manufacturer: Hosonic(鸿星电子); RK PN: ETDE32.768W125BMPF; Priority: A; Part Type: CRYSTAL; Manufacturer PN: ETDE32.768W125BMPF; Created by: JJJ
*#16 = radxa_1010: Page Create Date: March  8, 1995

## Sheet 18.SchDoc
size 297 x 209 mm
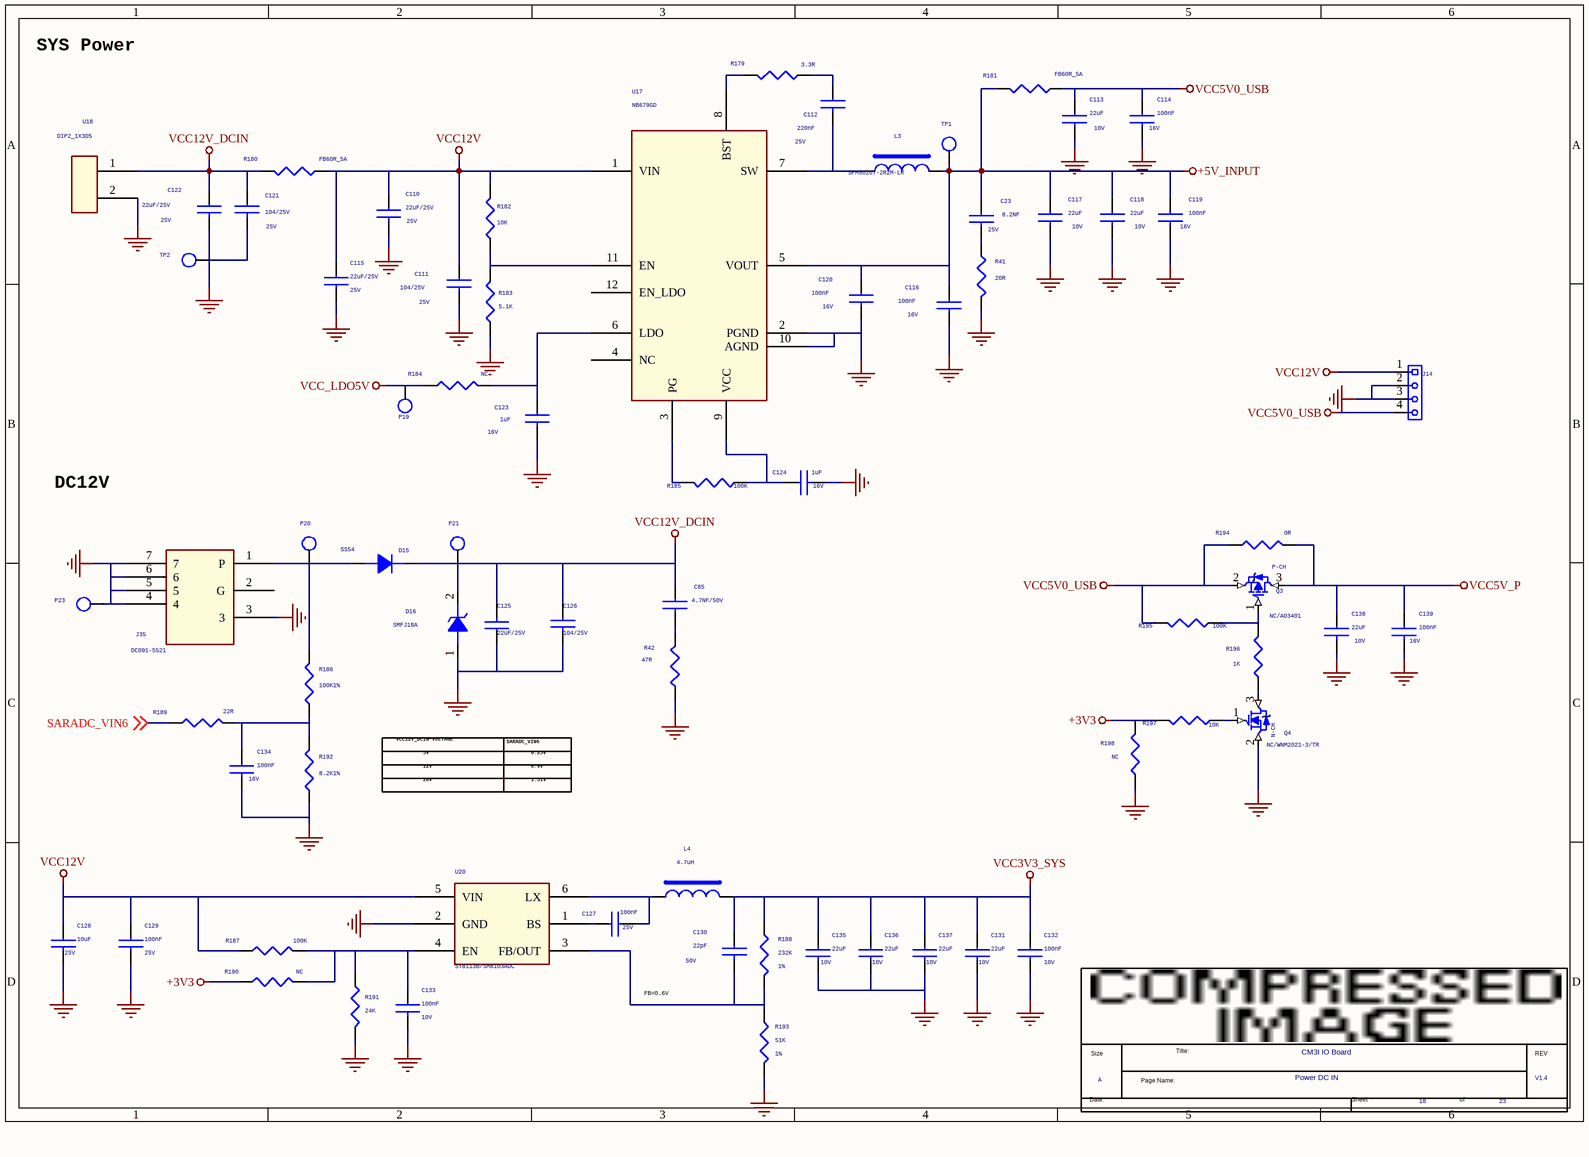
[diagram p16: 18.SchDoc]

### Parts
(Parts that share a designator on the sheet are numbered #1, #2 ... from top to bottom, then left to right.)
*#17  Page Count: 23  Page Number: 18  Page Size: A  Title: CM3I IO Board  RevCode: V1.4  Doc: Power DC IN  (hidden comment: radxa_1010)  (graphical)
C23  8.2NF  Voltage: 25V  [C0402]
C85  4.7NF/50V  [C0603]
C110  22uF/25V  Voltage: 25V  [C0805]
C111  104/25V  Voltage: 25V  [C0402]
C112  220nF  Voltage: 25V  [C0402]
C113  22uF  Voltage: 10V  [C0603]
C114  100nF  Voltage: 16V  [C0402]
C115  22uF/25V  Voltage: 25V  [C0805]
C116  100nF  Voltage: 16V  [C0402]
C117  22uF  Voltage: 10V  [C0603]
C118  22uF  Voltage: 10V  [C0603]
C119  100nF  Voltage: 16V  [C0402]
C120  100nF  Voltage: 16V  [C0402]
C121  104/25V  Voltage: 25V  [C0402]
C122  22uF/25V  Voltage: 25V  [C0805]
C123  1uF  Voltage: 16V  [C0402]
C124  1uF  Voltage: 16V  [C0402]
C125  22uF/25V  [C0805]
C126  104/25V  [C0402]
C127  100nF  Voltage: 25V  [C0402]
C128  10uF  Voltage: 25V  [C1206]
C129  100nF  Voltage: 25V  [C0402]
C130  22pF  Voltage: 50V  [C0402]
C131  22uF  Voltage: 10V  [C0805]
C132  100nF  Voltage: 10V  [C0402]
C133  100nF  Voltage: 10V  [C0402]
C134  100nF  Voltage: 16V  [C0402]
C135  22uF  Voltage: 10V  [C0805]
C136  22uF  Voltage: 10V  [C0805]
C137  22uF  Voltage: 10V  [C0805]
C138  22uF  Voltage: 10V  [C0603]
C139  100nF  Voltage: 16V  [C0402]
D15  SS54  [DO_214AC]
D16  SMFJ18A  [SOD_123]
J14  HEADER_1X4P  [header_1x4]  (value not drawn)
J35  DC091-5521  [DC091-5521]
L3  SPM5020T-2R2M-LR  [IND-5020]
L4  4.7uH  [IND-4X4]
P19  TEST  [TEST]  (value not drawn)
P20  TEST  [TEST]  (value not drawn)
P21  TEST  [TEST]  (value not drawn)
P23  TEST  [TEST]  (value not drawn)
Q3  NC/AO3401  [S0T-23]
Q4  NC/WNM2021-3/TR  [S0T-23]
R41  20R  [R0402]
R42  47R  [R0402]
R179  3.3R  [R0402]
R180  FB60R_5A  [R1206]
R181  FB60R_5A  [R1206]
R182  10K  [R0402]
R183  5.1K  [R0402]
R184  NC  [R0402]
R185  100K  [R0402]
R186  100K1%  [R0402]
R187  100K  [R0402]
R188  232K  Tolerance: 1%  [R0402]
R189  22R  [R0402]
R190  NC  [R0402]
R191  24K  [R0402]
R192  8.2K1%  [R0402]
R193  51K  Tolerance: 1%  [R0402]
R194  0R  [R0603]
R195  100K  [R0402]
R196  1K  [R0402]
R197  10K  [R0402]
R198  NC  [R0402]
TP1  TP_0.7  [TEST]  (value not drawn)
TP2  TP_0.7  [TEST]  (value not drawn)
U17  NB679GD  [QFN12_3R00X2R00X0R90]
U18  DIP2_1X3D5  [DIP2_1X3D5]
U20  SY8113B/SM8103ADC  [SOT_23_6]

### Nets
+3V3: R190.1 R197.2 R198.1
+5V_INPUT: C23.1 C116.1 C117.1 C118.1 C119.1 C120.1 L3.2 R181.2 TP1.1 U17.5(VOUT)
GND: C110.2 C111.2 C113.2 C114.2 C115.2 C116.2 C117.2 C118.2 C119.2 C120.2 C121.2 C122.2 C123.2 C124.2 C125.1 C126.2 C128.2 C129.2 C131.2 C132.2 C133.2 C134.2 C135.2 C136.2 C137.2 C138.2 C139.2 D16.1(ANODE) J14.2 J14.3 J35.3 J35.4 J35.5 J35.6 J35.7 P23.1 Q4.2(S) R41.2 R42.1 R183.1 R191.2 R192.1 R193.2 R198.2 TP2.1 U17.2(PGND) U17.10(AGND) U18.2 U20.2(GND)
VCC3V3_SYS: C130.1 C131.1 C132.1 C135.1 C136.1 C137.1 L4.2 R188.1
VCC5V0_USB: C113.1 C114.1 J14.4 Q3.2(S) R181.1 R194.2 R195.2
VCC5V_P: C138.1 C139.1 Q3.3(D) R194.1
VCC12V: C110.1 C111.1 C115.1 C128.1 C129.1 J14.1 R180.1 R182.2 R187.1 U17.1(VIN) U20.5(VIN)
VCC12V_DCIN: C85.1 C121.1 C122.1 C125.2 C126.1 D15.2(K) D16.2(CATHODE) P21.1 R180.2 U18.1
VCC_LDO5V: P19.1 R184.1
SARADC_VIN6: R189.1 ; off-sheet SARADC_VIN6
NetC23_2: C23.2 R41.1
NetC85_2: C85.2 R42.2
NetC112_1: C112.1 R179.2
NetC112_2: C112.2 L3.1 U17.7(SW)
NetC123_1: C123.1 R184.2 U17.6(LDO)
NetC124_1: C124.1 R185.2 U17.9(VCC)
NetC127_1: C127.1 U20.1(BS)
NetC127_2: C127.2 L4.1 U20.6(LX)
NetC130_2: C130.2 R188.2 R193.1 U20.3(FB/OUT)
NetC133_1: C133.1 R187.2 R190.2 R191.1 U20.4(EN)
NetC134_1: C134.1 R186.1 R189.2 R192.2
NetD15_1: D15.1(A) J35.1(P) P20.1 R186.2
NetQ3_1: Q3.1(G) R195.1 R196.1
NetQ4_1: Q4.1(G) R197.1
NetQ4_3: Q4.3(D) R196.2
NetR179_1: R179.1 U17.8(BST)
NetR182_1: R182.1 R183.2 U17.11(EN)
NetR185_1: R185.1 U17.3(PG)

Not connected (* = marked no-connect by the designer): J35 2(G); U17 4(NC) 12(EN_LDO)

### Notes on the sheet
- SYS Power
- DC12V
- VCC12V_DCIN-VOLTAGE
- SARADC_VIN6
- 5V
- 12V
- 20V
- 0.25V
- 1.51V
- 0.9V
- FB=0.6V
- (in symbol N-MOSFET) N-CH
- (in symbol P-MOSFET) P-CH
- (in symbol radxa_1010) Title:; Size; REV; Page Name:; Date:; Sheet; of

### Library data of the parts
C23 = CAP NP_0_Dup1: cap,100.00nF,+/-10%,16V,X5R,C0402; Manufacturer PN: C1005X5R1C104K050BA; Manufacturer: TDK; Tolerance: 10%; Priority: A; Dielectric: X5R; Created by: JJJ; Part Type: C0402; RK PN: C1005X5R1C104K050BA
C85 = CAP NP_0_Dup1: Priority: A
C110 C122 = CAP NP_0: cap,10.00uF,+/-10%,16V,X5R,C0805; Manufacturer: TDK; RK PN: C2012X5R1C106K125AC; Priority: A; Tolerance: 10%; Dielectric: X5R; Part Type: C0805; Manufacturer PN: C2012X5R1C106K125AC; Created by: JJJ
C111 C123 = CAP NP_0: cap,1.00uF,+/-10%,16V,X5R,C0402; Manufacturer: TDK; RK PN: C1005X5R1C105K050BC; Priority: A; Tolerance: 10%; Dielectric: X5R; Part Type: C0402; Manufacturer PN: C1005X5R1C105K050BC; Created by: JJJ
C112 = CAP NP_0: cap,220.00nF,+/-10%,25V,X5R,C0402; Manufacturer PN: C1005X5R1E224K050BC; Manufacturer: TDK; Tolerance: 10%; Priority: A; Dielectric: X5R; Created by: JJJ; Part Type: C0402; RK PN: C1005X5R1E224K050BC
C113 C117 C118 C138 = CAP NP_0: cap,22.00uF,+/-10%,10V,X5R,C0805; Manufacturer PN: C2012X5R1A226K125AB; Manufacturer: TDK; Tolerance: 10%; Priority: A; Dielectric: X5R; Created by: JJJ; Part Type: C0805; RK PN: C2012X5R1A226K125AB
C114 C119 = CAP NP_0: cap,100.00nF,+/-10%,16V,X5R,C0402; Manufacturer: TDK; RK PN: C1005X5R1C104K050BA; Priority: A; Tolerance: 10%; Dielectric: X5R; Part Type: C0402; Manufacturer PN: C1005X5R1C104K050BA; Created by: JJJ
C115 = CAP NP_0: cap,10.00uF,+/-10%,16V,X5R,C0805; Manufacturer PN: C2012X5R1C106K125AC; Manufacturer: TDK; Tolerance: 10%; Priority: A; Dielectric: X5R; Created by: JJJ; Part Type: C0805; RK PN: C2012X5R1C106K125AC
C116 C120 C134 C139 = CAP NP_0: cap,100.00nF,+/-10%,16V,X5R,C0402; Manufacturer PN: C1005X5R1C104K050BA; Manufacturer: TDK; Tolerance: 10%; Priority: A; Dielectric: X5R; Created by: JJJ; Part Type: C0402; RK PN: C1005X5R1C104K050BA
C121 C124 = CAP NP_0: cap,1.00uF,+/-10%,16V,X5R,C0402; Manufacturer PN: C1005X5R1C105K050BC; Manufacturer: TDK; Tolerance: 10%; Priority: A; Dielectric: X5R; Created by: JJJ; Part Type: C0402; RK PN: C1005X5R1C105K050BC
C125 = CAP NP_4
C126 = CAP NP_Dup3: CAP,MLCC,1nF,+/-10%,X5R,6.3V,SMD0402; MARK: 22P; ROOM: USB+5V
C127 = CAP NP_0: cap,100.00nF,+/-10%,25V,X5R,C0402; Manufacturer: TDK; Number: 37; RK PN: C1005X5R1E104K050BC; Priority: A; Tolerance: 10%; C_Voltage: 6.3V; Dielectric: X5R; Part Type: C0402; Manufacturer PN: C1005X5R1E104K050BC; Created by: JJJ
C128 = CAP NP_0: cap,10.00uF,+/-10%,25V,X5R,C1206; Manufacturer: TDK; RK PN: C3216X5R1E106K085AC; Priority: A; C_Voltage: 6.3V; Tolerance: 10%; Dielectric: X5R; Part Type: C1206; Manufacturer PN: C3216X5R1E106K085AC; Created by: JJJ
C129 = CAP NP_0: cap,100.00nF,+/-10%,25V,X5R,C0402; Manufacturer PN: C1005X5R1E104K050BC; Manufacturer: TDK; Tolerance: 10%; Priority: A; Dielectric: X5R; Created by: JJJ; Part Type: C0402; RK PN: C1005X5R1E104K050BC
C130 = CAP NP_0: cap,22.00pF,+/-5%,50V,C0G,C0402; Manufacturer: TDK; RK PN: C1005C0G1H220J050BA; Priority: A; Tolerance: 5%; Dielectric: C0G; Part Type: C0402; Manufacturer PN: C1005C0G1H220J050BA; Created by: JJJ
C131 C136 = CAP NP_0: cap,22.00uF,+/-10%,10V,X5R,C0805; Manufacturer: TDK; RK PN: C2012X5R1A226K125AB; Priority: A; C_Voltage: 6.3V; Tolerance: 10%; Dielectric: X5R; Part Type: C0805; Manufacturer PN: C2012X5R1A226K125AB; Created by: JJJ
C132 = CAP NP_0: cap,100.00nF,+/-10%,10V,X5R,C0402; Manufacturer PN: C1005X5R1A104K050BA; Manufacturer: TDK; C_Voltage: 6.3V; Tolerance: 10%; Priority: A; Number: 37; Dielectric: X5R; Created by: JJJ; Part Type: C0402; RK PN: C1005X5R1A104K050BA
C133 = CAP NP_0: cap,100.00nF,+/-10%,10V,X5R,C0402; Manufacturer: TDK; Number: 37; RK PN: C1005X5R1A104K050BA; Priority: A; Tolerance: 10%; C_Voltage: 6.3V; Dielectric: X5R; Part Type: C0402; Manufacturer PN: C1005X5R1A104K050BA; Created by: JJJ
C135 C137 = CAP NP_0: cap,22.00uF,+/-10%,10V,X5R,C0805; Manufacturer PN: C2012X5R1A226K125AB; Manufacturer: TDK; Tolerance: 10%; C_Voltage: 6.3V; Priority: A; Dielectric: X5R; Created by: JJJ; Part Type: C0805; RK PN: C2012X5R1A226K125AB
D15 = DIODE_Dup1: Schottky Barrier，SS32 DO214AC; Manufacturer: 星海; ROOM: CHG; RK PN: SS32; Priority: A; Part Type: Schottky rectifier; Manufacturer PN: SS32; Created by: JJJ
D16 = DIODE ZENER1: 1-Line, Uni-directional, Transient Voltage Suppressor; Manufacturer: WillSemi(韦尔半导体); RK PN: ESD5621W-2/TR; Priority: A; Part Type: ESD_TVS; Manufacturer PN: ESD5621W-2/TR; Created by: JJJ
J14 = HEADER_1X4P: PINREX/210-91-04GB01       <G>; Critical_Part: N; Manufacture: PINREX; Part Number: 12G06000004P; Device: hd_1x4p_100_pinrex_lf3; Symbol_pic: K:\Symbol_Pic\12-CONNECTOR\12G06000004P_MID.zip; metal_fabrication: 00000011; Class: IO; FPLIST: hd_1x4p_100_pinrex_lf3,mb_hd_1x4p_100_lf3; Data_Sheet: K:\DataSheet\12-CONNECTOR\12G06000004P.pdf; Sourcer: 法醇稻(X17175); Electric_SPE: BLACK; Component_Name: HEADER 1X4P S/T 2.54mm G/F; Colay_Alternate: N/A; Colay_Group: N/A; Subsystem_ID: N/A; Optional: N/A; Modify_Data: 2007/8/2; Database_Update: 2007/4/17; Part Type: 12CONNECTOR\HEADER; Package_Type: DIP; Status: All 某纔舦0005
L3 = INDUCTORS OF FERRITE
L4 = INDUCTORS OF FERRITE_Dup1: Power Inductor,4.7uH,0.2,IND_606045; Manufacturer: sunlord; DC Resistor: 0.02ohm; Isat: 4.97A; RK PN: SWPA6045S4R7MT; Priority: A; Tolerance: 20%; Irms: 3.3A; Resonace frequency: 24M; Part Type: POWER_IND; Manufacturer PN: SWPA6045S4R7MT; Created by: YWQ
P19-P21 P23 = TESTPOINT1
Q3 = P-MOSFET: SANZ_P/N: SK2301; Part Type: MOS管
Q4 = N-MOSFET: SANZ_P/N: SK2300; Part Type: MOS管
R41 = RESISTOR_0_Dup2: 通用厚膜电阻,47K,+/-5%,R0402,1/16W.; Manufacturer PN: RC0402JR-0747KL; Manufacturer: YAGEO; Tolerance: 5%; Wattage: 1/16W; Priority: A; Created by: YTL; Part Type: 通用厚膜电阻; RK PN: RC0402JR-0747KL
R42 = RESISTOR_0_Dup2: 通用厚膜电阻,330R,+/-5%,R0402,1/16W.; Manufacturer PN: RC0402JR-07330RL; Manufacturer: YAGEO; Tolerance: 5%; Wattage: 1/16W; Priority: A; Created by: YTL; Part Type: 通用厚膜电阻; RK PN: RC0402JR-07330RL
R179 = RESISTOR_0_Dup1: 通用厚膜电阻,3R3,+/-5%,R0402,1/16W.; Manufacturer PN: RC0402JR-073R3L; Manufacturer: YAGEO; Tolerance: 5%; Wattage: 1/16W; Priority: A; Created by: YTL; Part Type: 通用厚膜电阻; RK PN: RC0402JR-073R3L
R180 R181 = R_0
R182 = RESISTOR_0_Dup1: 通用厚膜电阻,10K,+/-5%,R0402,1/16W.; Manufacturer PN: RC0402JR-0710KL; Manufacturer: YAGEO; Tolerance: 5%; Wattage: 1/16W; Priority: A; Created by: YTL; Part Type: 通用厚膜电阻; RK PN: RC0402JR-0710KL
R183 = RESISTOR_0_Dup1: 通用厚膜电阻,10K,+/-5%,R0402,1/16W.; Manufacturer: YAGEO; Tolerance: 5%; RK PN: RC0402JR-0710KL; Priority: A; Wattage: 1/16W; Part Type: 通用厚膜电阻; Manufacturer PN: RC0402JR-0710KL; Created by: YTL
R184 = RESISTOR_2_Dup1: 通用厚膜电阻,10K,+/-5%,R0402,1/16W.; Manufacturer PN: RC0402JR-0710KL; Manufacturer: YAGEO; Tolerance: 5%; Wattage: 1/16W; Priority: A; Created by: YTL; Part Type: 通用厚膜电阻; RK PN: RC0402JR-0710KL
R185 R190 = RESISTOR_0_Dup1: 通用厚膜电阻,100K,+/-5%,R0402,1/16W.; Manufacturer: YAGEO; Tolerance: 5%; RK PN: RC0402JR-07100KL; Priority: A; Wattage: 1/16W; Part Type: 通用厚膜电阻; Manufacturer PN: RC0402JR-07100KL; Created by: YTL
R186 R189 R192 = RESISTOR_2_Dup1: 通用厚膜电阻,10K,+/-5%,R0402,1/16W.; Manufacturer: YAGEO; Tolerance: 5%; RK PN: RC0402JR-0710KL; Priority: A; Wattage: 1/16W; Part Type: 通用厚膜电阻; Manufacturer PN: RC0402JR-0710KL; Created by: YTL
R187 = RESISTOR_0_Dup1: 通用厚膜电阻,100K,+/-5%,R0402,1/16W.; Manufacturer PN: RC0402JR-07100KL; Manufacturer: YAGEO; Tolerance: 5%; Wattage: 1/16W; Priority: A; Created by: YTL; Part Type: 通用厚膜电阻; RK PN: RC0402JR-07100KL
R188 = RESISTOR_0_Dup1: 通用厚膜电阻,232K,+/-1%,R0402,1/16W.; Manufacturer PN: RC0402FR-07232KL; Manufacturer: YAGEO; Wattage: 1/16W; Priority: A; Created by: YTL; Part Type: 通用厚膜电阻; RK PN: RC0402FR-07232KL
R191 = RESISTOR_0_Dup1: 通用厚膜电阻,24K,+/-5%,R0402,1/16W.; Manufacturer: YAGEO; Tolerance: 5%; RK PN: RC0402JR-0724KL; Priority: A; Wattage: 1/16W; Part Type: 通用厚膜电阻; Manufacturer PN: RC0402JR-0724KL; Created by: YTL
R193 = RESISTOR_0_Dup1: 通用厚膜电阻,49K9,+/-1%,R0402,1/16W.; Manufacturer PN: RC0402FR-0749K9L; Manufacturer: YAGEO; Wattage: 1/16W; Priority: A; Created by: YTL; Part Type: 通用厚膜电阻; RK PN: RC0402FR-0749K9L
R194 R195 R197 = RESISTOR_1_Dup1: RES,thick film,47KOhm,+/-5%,1/16W,SMD0402
R196 R198 = RESISTOR_0_Dup6: RES,thick film,47KOhm,+/-5%,1/16W,SMD0402; MARK: 51K
TP1 TP2 = TP: Test Point 0.7mm; RK PN: TESTPOINT_0R7; Priority: A; Part Type: TP; Created by: JJJ
U17 = DCDC_NB679: 26 V, Low Iq, High Current, Fixed 5 V-8 A Synchronous Buck Converter with 100 mA LDO;; Manufacturer: MPS （美国芯源）; Created by: JJJ; Manufacturer PN: NB679GD; Part Type: DCDC; Priority: A; RK PN: NB679GD
U18 = CON3_7
U20 = DCDC_SY8113: Manufacturer: Silergy（矽力杰）; Priority: A; RK PN: SY8113B; Part Type: DCDC; Manufacturer PN: SY8113B; Created by: JJJ
*#17 = radxa_1010: Page Create Date: March  8, 1995

## Sheet 19.SchDoc
size 297 x 209 mm
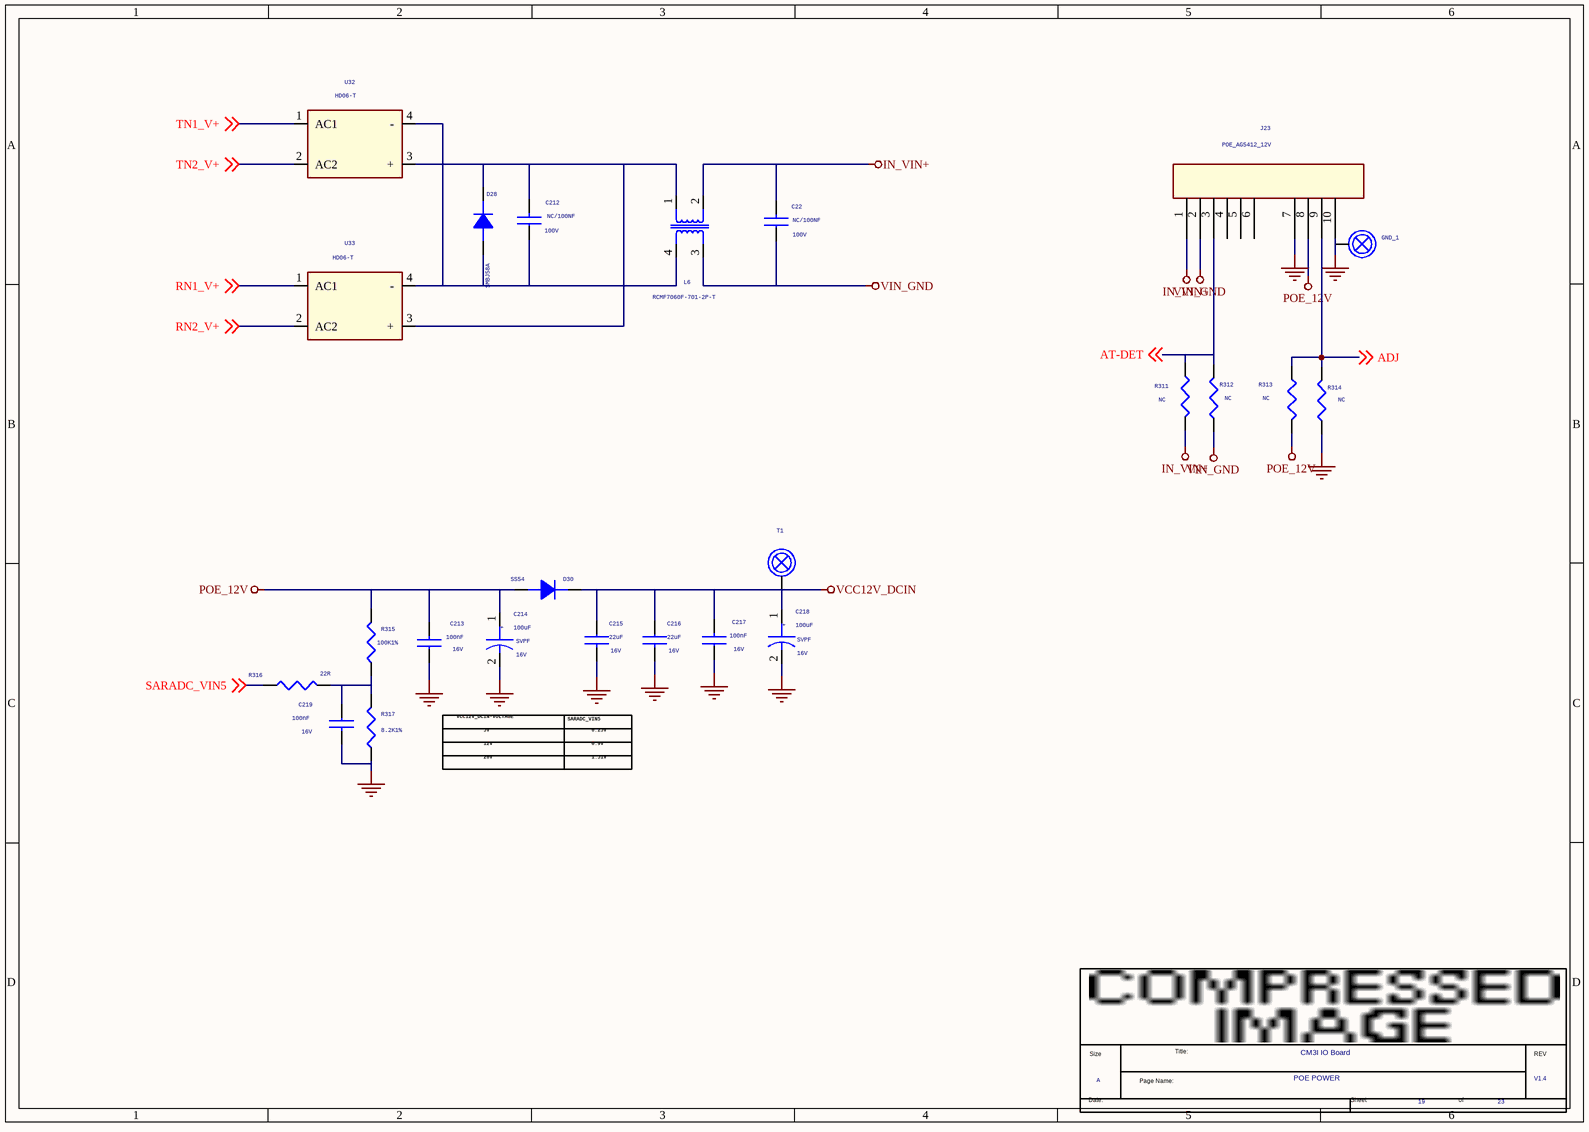
[diagram p17: 19.SchDoc]

### Parts
(Parts that share a designator on the sheet are numbered #1, #2 ... from top to bottom, then left to right.)
*#18  Page Count: 23  Page Number: 19  Page Size: A  Title: CM3I IO Board  RevCode: V1.4  Doc: POE POWER  (hidden comment: radxa_1010)  (graphical)
C22  NC/100NF  Voltage: 100V  [C0603]
C212  NC/100NF  Voltage: 100V  [C0603]
C213  100nF  Voltage: 16V  [C0402]
C214  100uF  Dielectric: SVPF  Voltage: 16V  [CAP_SM_6D3X7D7_1]
C215  22uF  Voltage: 16V  [C0805]
C216  22uF  Voltage: 16V  [C0805]
C217  100nF  Voltage: 16V  [C0402]
C218  100uF  Dielectric: SVPF  Voltage: 16V  [CAP_SM_6D3X7D7_1]
C219  100nF  Voltage: 16V  [C0402]
D28  SMBJ58A  [DO_214AA]
D30  SS54  [DO_214AC]
GND_1  GND  [TP32]  (value not drawn)
J23  POE_AG5412_12V  [DIP_POE_AG5412]
L6  RCMF7060F-701-2P-T  [RCMF7060]
R311  NC  [R0402]
R312  NC  [R0402]
R313  NC  [R0402]
R314  NC  [R0402]
R315  100K1%  [R0402]
R316  22R  [R0402]
R317  8.2K1%  [R0402]
T1  12V  [TP32]  (value not drawn)
U32  HD06-T  [SOP4_1D27_4]
U33  HD06-T  [SOP4_1D27_4]

### Nets
GND: C213.1 C214.2 C215.2 C216.2 C217.1 C218.2 C219.2 GND_1.1 J23.7(-VDC) J23.10(-VDC) R314.2 R317.1
IN_VIN+: C22.2 J23.1(VIN+) L6.2(R4) R311.2
POE_12V: C213.2 C214.1 D30.1(A) J23.8(+VDC) R313.2 R315.2
VCC12V_DCIN: C215.1 C216.1 C217.2 C218.1 D30.2(K) T1.1
VIN_GND: C22.1 J23.2(VIN-) L6.3(R3) R312.2
ADJ: J23.9(ADJ) R313.1 R314.1 ; off-sheet ADJ
AT-DET: J23.3(AT-DET) R311.1 R312.1 ; off-sheet AT-DET
RN1_V+: U33.1(AC1) ; off-sheet RN1_V+
RN2_V+: U33.2(AC2) ; off-sheet RN2_V+
SARADC_VIN5: R316.1 ; off-sheet SARADC_VIN5
TN1_V+: U32.1(AC1) ; off-sheet TN1_V+
TN2_V+: U32.2(AC2) ; off-sheet TN2_V+
NetC212_1: C212.1 D28.1(ANODE) L6.4(R2) U32.4(-) U33.4(-)
NetC212_2: C212.2 D28.2(CATHODE) L6.1(R1) U32.3(+) U33.3(+)
NetC219_1: C219.1 R315.1 R316.2 R317.2

Not connected (* = marked no-connect by the designer): J23 4 5 6

### Notes on the sheet
- VCC12V_DCIN-VOLTAGE
- 5V
- 12V
- SARADC_VIN5
- 0.25V
- 0.9V
- 20V
- 1.51V
- (in symbol CAP) +
- (in symbol radxa_1010) Title:; Size; REV; Page Name:; Date:; Sheet; of

### Library data of the parts
C22 = CAP NP_0: cap,10.00uF,+/-10%,6.3V,X5R,C0603; Manufacturer: TDK; RK PN: C1608X5R0J106K080AB; Priority: A; Tolerance: 10%; Dielectric: X5R; Part Type: C0402; Manufacturer PN: C1608X5R0J106K080AB; Created by: JJJ
C212 = CAP NP_0: cap,10.00uF,+/-10%,6.3V,X5R,C0603; Manufacturer PN: C1608X5R0J106K080AB; Manufacturer: TDK; Tolerance: 10%; Priority: A; Dielectric: X5R; Created by: JJJ; Part Type: C0402; RK PN: C1608X5R0J106K080AB
C213 = CAP NP_0: cap,1.00uF,+/-10%,10V,X5R,C0402; Manufacturer: TDK; RK PN: C1005X5R1A105K050BB; Priority: A; Tolerance: 10%; Dielectric: X5R; Part Type: C0402; Manufacturer PN: C1005X5R1A105K050BB; Created by: JJJ
C214 = CAP: 47uF,25V,30mR,SVPF; Manufacturer: Panasonic; RK PN: 25SVPF47M; Priority: A; Tolerance: 20%; Part Type: CAP_SM_6D3X7D7_1; Manufacturer PN: 25SVPF47M; Created by: JJJ
C215 = CAP NP_0: as C113 on sheet 18; Dielectric: X5R; Created by: JJJ; Part Type: C0805; RK PN: C2012X5R1A226K125AB
C216 = CAP NP_0: cap,22.00uF,+/-10%,10V,X5R,C0805; Manufacturer: TDK; RK PN: C2012X5R1A226K125AB; Priority: A; Tolerance: 10%; Dielectric: X5R; Part Type: C0805; Manufacturer PN: C2012X5R1A226K125AB; Created by: JJJ
C217 = CAP NP_0: cap,1.00uF,+/-10%,10V,X5R,C0402; Manufacturer PN: C1005X5R1A105K050BB; Manufacturer: TDK; Tolerance: 10%; Priority: A; Dielectric: X5R; Created by: JJJ; Part Type: C0402; RK PN: C1005X5R1A105K050BB
C218 = CAP: 47uF,25V,30mR,SVPF; Manufacturer PN: 25SVPF47M; Manufacturer: Panasonic; Tolerance: 20%; Priority: A; Created by: JJJ; Part Type: CAP_SM_6D3X7D7_1; RK PN: 25SVPF47M
C219 = CAP NP_0: as C116 on sheet 18; Dielectric: X5R; Created by: JJJ; Part Type: C0402; RK PN: C1005X5R1C104K050BA
D28 = DIODE_1: 贴片TVS管 SMBJ58A 58V 6.5A SMB 君耀; Part Number: 911110000068; Approved: 已承认; Grade: B; Part Type: 二极管
D30 = DIODE_Dup1: as D15 on sheet 18; Part Type: Schottky rectifier; Manufacturer PN: SS32; Created by: JJJ
GND_1 T1 = TEST: 测试点-电源; Part Type: 测试点
J23 = CON4_1
L6 = R-PACK4_1
R311 = RESISTOR_0_Dup1: 通用厚膜电阻,47K,+/-5%,R0402,1/16W.; Manufacturer PN: RC0402JR-0747KL; Manufacturer: YAGEO; Tolerance: 5%; Wattage: 1/16W; Priority: A; Created by: YTL; Part Type: 通用厚膜电阻; RK PN: RC0402JR-0747KL
R312-R314 = RESISTOR_0_Dup1: 通用厚膜电阻,47K,+/-5%,R0402,1/16W.; Manufacturer: YAGEO; Tolerance: 5%; RK PN: RC0402JR-0747KL; Priority: A; Wattage: 1/16W; Part Type: 通用厚膜电阻; Manufacturer PN: RC0402JR-0747KL; Created by: YTL
R315 R317 = RESISTOR_2_Dup1: as R186 on sheet 18; Part Type: 通用厚膜电阻; Manufacturer PN: RC0402JR-0710KL; Created by: YTL
R316 = RESISTOR_2_Dup1: as R184 on sheet 18; Created by: YTL; Part Type: 通用厚膜电阻; RK PN: RC0402JR-0710KL
U32 = RECTIFIER_B: 贴片整流桥 DI2010S 1000V 2A SDIP 4Pin PANJIT; Part Number: 911130000003; Approved: 未承认; Grade: B; Part Type: 二极管
U33 = RECTIFIER_B: 贴片整流桥 DI2010S 1000V 2A SDIP 4Pin PANJIT; Part Number: 911130000003; Grade: B; Approved: 未承认; Part Type: 二极管
*#18 = radxa_1010: Page Create Date: March  8, 1995

## Sheet 20.SchDoc
size 297 x 209 mm
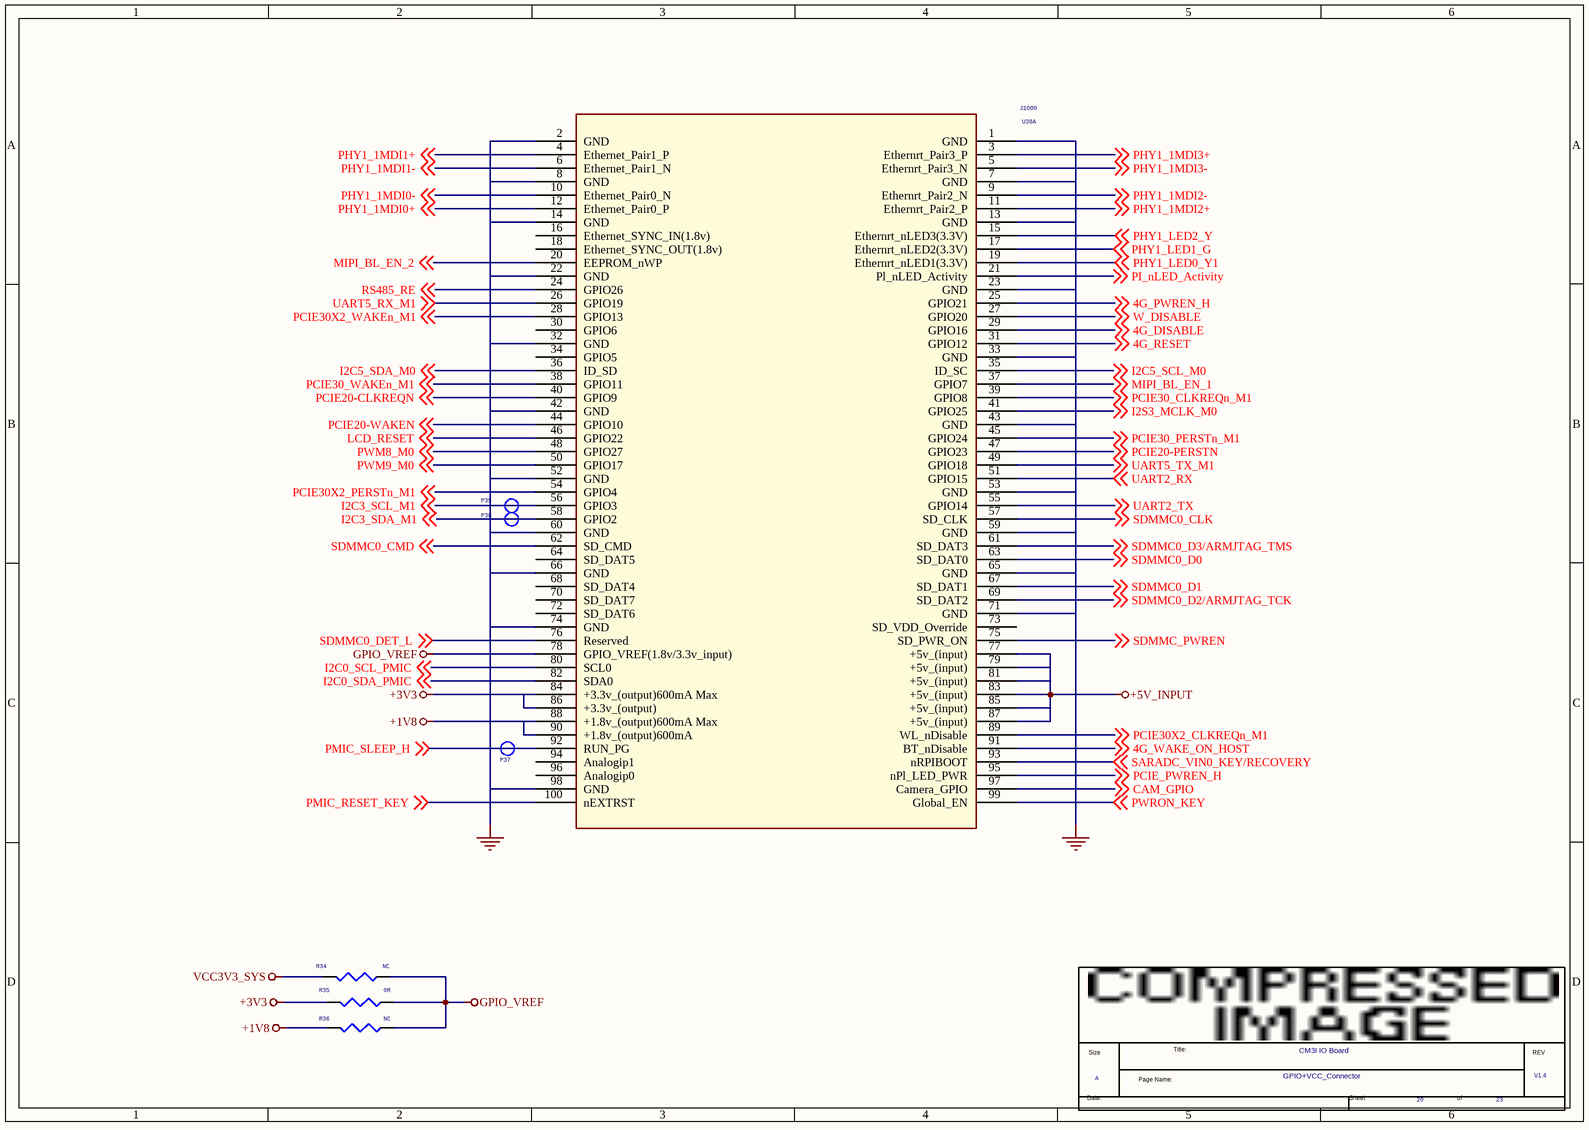
[diagram p18: 20.SchDoc]

### Parts
(Parts that share a designator on the sheet are numbered #1, #2 ... from top to bottom, then left to right.)
*#19  Page Count: 23  Page Number: 20  Page Size: A  Title: CM3I IO Board  RevCode: V1.4  Doc: GPIO+VCC_Connector  (hidden comment: radxa_1010)  (graphical)
P35  TEST  [TEST]  (value not drawn)
P36  TEST  [TEST]  (value not drawn)
P37  TEST  [TEST]  (value not drawn)
R34  NC  [R0402]
R35  0R  [R0402]
R36  NC  [R0402]
U38  J1000  [DF40C-200DS-70X40_MZ_3D5]  (part A of 2)

### Nets
+1V8: R36.2 U38.88(+1.8v_(output)600mA_Max) U38.90(+1.8v_(output)600mA)
+3V3: R35.2 U38.84(+3.3v_(output)600mA_Max) U38.86(+3.3v_(output))
+5V_INPUT: U38.77(+5v_(input)) U38.79(+5v_(input)) U38.81(+5v_(input)) U38.83(+5v_(input)) U38.85(+5v_(input)) U38.87(+5v_(input))
GND: U38.1(GND) U38.2(GND) U38.7(GND) U38.8(GND) U38.13(GND) U38.14(GND) U38.22(GND) U38.23(GND) U38.32(GND) U38.33(GND) U38.42(GND) U38.43(GND) U38.52(GND) U38.53(GND) U38.59(GND) U38.60(GND) U38.65(GND) U38.66(GND) U38.71(GND) U38.74(GND) U38.98(GND)
GPIO_VREF: R34.1 R35.1 R36.1 U38.78(GPIO_VREF(1.8v/3.3v_input))
VCC3V3_SYS: R34.2
4G_DISABLE: U38.29(GPIO16) ; off-sheet 4G_DISABLE
4G_PWREN_H: U38.25(GPIO21) ; off-sheet 4G_PWREN_H
4G_RESET: U38.31(GPIO12) ; off-sheet 4G_RESET
4G_WAKE_ON_HOST: U38.91(BT_nDisable) ; off-sheet 4G_WAKE_ON_HOST
CAM_GPIO: U38.97(Camera_GPIO) ; off-sheet CAM_GPIO
I2C0_SCL_PMIC: U38.80(SCL0) ; off-sheet I2C0_SCL_PMIC
I2C0_SDA_PMIC: U38.82(SDA0) ; off-sheet I2C0_SDA_PMIC
I2C3_SCL_M1: P35.1 U38.56(GPIO3) ; off-sheet I2C3_SCL_M1
I2C3_SDA_M1: P36.1 U38.58(GPIO2) ; off-sheet I2C3_SDA_M1
I2C5_SCL_M0: U38.35(ID_SC) ; off-sheet I2C5_SCL_M0
I2C5_SDA_M0: U38.36(ID_SD) ; off-sheet I2C5_SDA_M0
I2S3_MCLK_M0: U38.41(GPIO25) ; off-sheet I2S3_MCLK_M0
LCD_RESET: U38.46(GPIO22) ; off-sheet LCD_RESET
MIPI_BL_EN_1: U38.37(GPIO7) ; off-sheet MIPI_BL_EN_1
MIPI_BL_EN_2: U38.20(EEPROM_nWP) ; off-sheet MIPI_BL_EN_2
PCIE20-CLKREQN: U38.40(GPIO9) ; off-sheet PCIE20-CLKREQN
PCIE20-PERSTN: U38.47(GPIO23) ; off-sheet PCIE20-PERSTN
PCIE20-WAKEN: U38.44(GPIO10) ; off-sheet PCIE20-WAKEN
PCIE30_CLKREQn_M1: U38.39(GPIO8) ; off-sheet PCIE30_CLKREQn_M1
PCIE30_PERSTn_M1: U38.45(GPIO24) ; off-sheet PCIE30_PERSTn_M1
PCIE30_WAKEn_M1: U38.38(GPIO11) ; off-sheet PCIE30_WAKEn_M1
PCIE30X2_CLKREQn_M1: U38.89(WL_nDisable) ; off-sheet PCIE30X2_CLKREQn_M1
PCIE30X2_PERSTn_M1: U38.54(GPIO4) ; off-sheet PCIE30X2_PERSTn_M1
PCIE30X2_WAKEn_M1: U38.28(GPIO13) ; off-sheet PCIE30X2_WAKEn_M1
PCIE_PWREN_H: U38.95(nPl_LED_PWR) ; off-sheet PCIE_PWREN_H
PHY1_1MDI0+: U38.12(Ethernet_Pair0_P) ; off-sheet PHY1_1MDI0+
PHY1_1MDI0-: U38.10(Ethernet_Pair0_N) ; off-sheet PHY1_1MDI0-
PHY1_1MDI1+: U38.4(Ethernet_Pair1_P) ; off-sheet PHY1_1MDI1+
PHY1_1MDI1-: U38.6(Ethernet_Pair1_N) ; off-sheet PHY1_1MDI1-
PHY1_1MDI2+: U38.11(Ethernrt_Pair2_P) ; off-sheet PHY1_1MDI2+
PHY1_1MDI2-: U38.9(Ethernrt_Pair2_N) ; off-sheet PHY1_1MDI2-
PHY1_1MDI3+: U38.3(Ethernrt_Pair3_P) ; off-sheet PHY1_1MDI3+
PHY1_1MDI3-: U38.5(Ethernrt_Pair3_N) ; off-sheet PHY1_1MDI3-
PHY1_LED0_Y1: U38.19(Ethernrt_nLED1(3.3V)) ; off-sheet PHY1_LED0_Y1
PHY1_LED1_G: U38.17(Ethernrt_nLED2(3.3V)) ; off-sheet PHY1_LED1_G
PHY1_LED2_Y: U38.15(Ethernrt_nLED3(3.3V)) ; off-sheet PHY1_LED2_Y
PI_nLED_Activity: U38.21(Pl_nLED_Activity) ; off-sheet PI_nLED_Activity
PMIC_RESET_KEY: U38.100(nEXTRST) ; off-sheet PMIC_RESET_KEY
PMIC_SLEEP_H: P37.1 U38.92(RUN_PG) ; off-sheet PMIC_SLEEP_H
PWM8_M0: U38.48(GPIO27) ; off-sheet PWM8_M0
PWM9_M0: U38.50(GPIO17) ; off-sheet PWM9_M0
PWRON_KEY: U38.99(Global_EN) ; off-sheet PWRON_KEY
RS485_RE: U38.24(GPIO26) ; off-sheet RS485_RE
SARADC_VIN0_KEY/RECOVERY: U38.93(nRPIBOOT) ; off-sheet SARADC_VIN0_KEY/RECOVERY
SDMMC0_CLK: U38.57(SD_CLK) ; off-sheet SDMMC0_CLK
SDMMC0_CMD: U38.62(SD_CMD) ; off-sheet SDMMC0_CMD
SDMMC0_D0: U38.63(SD_DAT0) ; off-sheet SDMMC0_D0
SDMMC0_D1: U38.67(SD_DAT1) ; off-sheet SDMMC0_D1
SDMMC0_D2/ARMJTAG_TCK: U38.69(SD_DAT2) ; off-sheet SDMMC0_D2/ARMJTAG_TCK
SDMMC0_D3/ARMJTAG_TMS: U38.61(SD_DAT3) ; off-sheet SDMMC0_D3/ARMJTAG_TMS
SDMMC0_DET_L: U38.76(Reserved) ; off-sheet SDMMC0_DET_L
SDMMC_PWREN: U38.75(SD_PWR_ON) ; off-sheet SDMMC_PWREN
UART2_RX: U38.51(GPIO15) ; off-sheet UART2_RX
UART2_TX: U38.55(GPIO14) ; off-sheet UART2_TX
UART5_RX_M1: U38.26(GPIO19) ; off-sheet UART5_RX_M1
UART5_TX_M1: U38.49(GPIO18) ; off-sheet UART5_TX_M1
W_DISABLE: U38.27(GPIO20) ; off-sheet W_DISABLE

Not connected (* = marked no-connect by the designer): U38 16(Ethernet_SYNC_IN(1.8v)) 18(Ethernet_SYNC_OUT(1.8v)) 30(GPIO6) 34(GPIO5) 64(SD_DAT5) 68(SD_DAT4) 70(SD_DAT7) 72(SD_DAT6) 73(SD_VDD_Override) 94(Analogip1) 96(Analogip0)

### Notes on the sheet
- (in symbol radxa_1010) Title:; Size; REV; Page Name:; Date:; Sheet; of

### Library data of the parts
P35-P37 = TESTPOINT1
R34-R36 = RESISTOR_0_Dup1: 通用厚膜电阻,100R,+/-5%,R0402,1/16W.; Manufacturer PN: RC0402JR-07100RL; Manufacturer: YAGEO; Tolerance: 5%; Wattage: 1/16W; Priority: A; Created by: YTL; Part Type: 通用厚膜电阻; RK PN: RC0402JR-07100RL
U38 = HETER_4
*#19 = radxa_1010: Page Create Date: March  8, 1995

## Sheet 21.SchDoc
size 297 x 209 mm
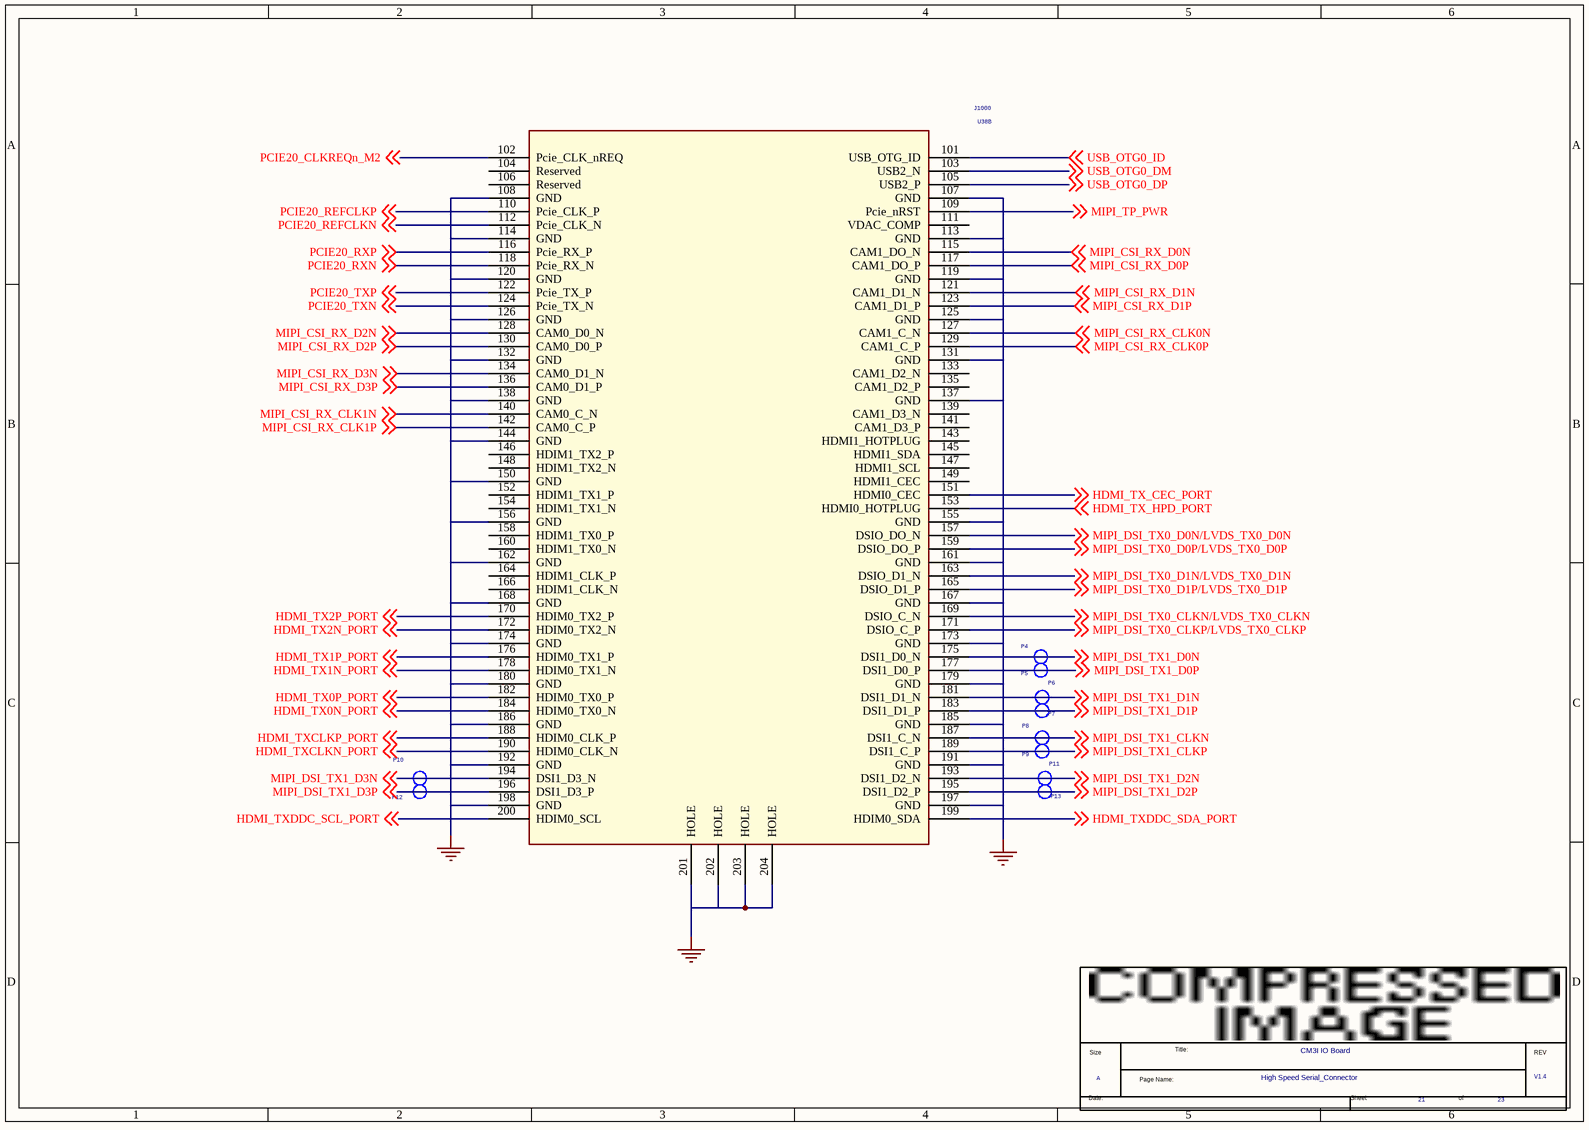
[diagram p19: 21.SchDoc]

### Parts
(Parts that share a designator on the sheet are numbered #1, #2 ... from top to bottom, then left to right.)
*#20  Page Count: 23  Page Number: 21  Page Size: A  Title: CM3I IO Board  RevCode: V1.4  Doc: High Speed Serial_Connector  (hidden comment: radxa_1010)  (graphical)
P4  TEST  [TEST]  (value not drawn)
P5  TEST  [TEST]  (value not drawn)
P6  TEST  [TEST]  (value not drawn)
P7  TEST  [TEST]  (value not drawn)
P8  TEST  [TEST]  (value not drawn)
P9  TEST  [TEST]  (value not drawn)
P10  TEST  [TEST]  (value not drawn)
P11  TEST  [TEST]  (value not drawn)
P12  TEST  [TEST]  (value not drawn)
P13  TEST  [TEST]  (value not drawn)
U38  J1000  [DF40C-200DS-70X40_MZ_3D5]  (part B of 2)

### Nets
GND: U38.107(GND) U38.108(GND) U38.113(GND) U38.114(GND) U38.119(GND) U38.120(GND) U38.125(GND) U38.126(GND) U38.131(GND) U38.132(GND) U38.137(GND) U38.138(GND) U38.144(GND) U38.150(GND) U38.155(GND) U38.156(GND) U38.161(GND) U38.162(GND) U38.167(GND) U38.168(GND) U38.173(GND) U38.174(GND) U38.179(GND) U38.180(GND) U38.185(GND) U38.186(GND) U38.191(GND) U38.192(GND) U38.197(GND) U38.198(GND) U38.201(HOLE) U38.202(HOLE) U38.203(HOLE) U38.204(HOLE)
HDMI_TX0N_PORT: U38.184(HDIM0_TX0_N) ; off-sheet HDMI_TX0N_PORT
HDMI_TX0P_PORT: U38.182(HDIM0_TX0_P) ; off-sheet HDMI_TX0P_PORT
HDMI_TX1N_PORT: U38.178(HDIM0_TX1_N) ; off-sheet HDMI_TX1N_PORT
HDMI_TX1P_PORT: U38.176(HDIM0_TX1_P) ; off-sheet HDMI_TX1P_PORT
HDMI_TX2N_PORT: U38.172(HDIM0_TX2_N) ; off-sheet HDMI_TX2N_PORT
HDMI_TX2P_PORT: U38.170(HDIM0_TX2_P) ; off-sheet HDMI_TX2P_PORT
HDMI_TX_CEC_PORT: U38.151(HDMI0_CEC) ; off-sheet HDMI_TX_CEC_PORT
HDMI_TX_HPD_PORT: U38.153(HDMI0_HOTPLUG) ; off-sheet HDMI_TX_HPD_PORT
HDMI_TXCLKN_PORT: U38.190(HDIM0_CLK_N) ; off-sheet HDMI_TXCLKN_PORT
HDMI_TXCLKP_PORT: U38.188(HDIM0_CLK_P) ; off-sheet HDMI_TXCLKP_PORT
HDMI_TXDDC_SCL_PORT: U38.200(HDIM0_SCL) ; off-sheet HDMI_TXDDC_SCL_PORT
HDMI_TXDDC_SDA_PORT: U38.199(HDIM0_SDA) ; off-sheet HDMI_TXDDC_SDA_PORT
MIPI_CSI_RX_CLK0N: U38.127(CAM1_C_N) ; off-sheet MIPI_CSI_RX_CLK0N
MIPI_CSI_RX_CLK0P: U38.129(CAM1_C_P) ; off-sheet MIPI_CSI_RX_CLK0P
MIPI_CSI_RX_CLK1N: U38.140(CAM0_C_N) ; off-sheet MIPI_CSI_RX_CLK1N
MIPI_CSI_RX_CLK1P: U38.142(CAM0_C_P) ; off-sheet MIPI_CSI_RX_CLK1P
MIPI_CSI_RX_D0N: U38.115(CAM1_DO_N) ; off-sheet MIPI_CSI_RX_D0N
MIPI_CSI_RX_D0P: U38.117(CAM1_DO_P) ; off-sheet MIPI_CSI_RX_D0P
MIPI_CSI_RX_D1N: U38.121(CAM1_D1_N) ; off-sheet MIPI_CSI_RX_D1N
MIPI_CSI_RX_D1P: U38.123(CAM1_D1_P) ; off-sheet MIPI_CSI_RX_D1P
MIPI_CSI_RX_D2N: U38.128(CAM0_D0_N) ; off-sheet MIPI_CSI_RX_D2N
MIPI_CSI_RX_D2P: U38.130(CAM0_D0_P) ; off-sheet MIPI_CSI_RX_D2P
MIPI_CSI_RX_D3N: U38.134(CAM0_D1_N) ; off-sheet MIPI_CSI_RX_D3N
MIPI_CSI_RX_D3P: U38.136(CAM0_D1_P) ; off-sheet MIPI_CSI_RX_D3P
MIPI_DSI_TX0_CLKN/LVDS_TX0_CLKN: U38.169(DSIO_C_N) ; off-sheet MIPI_DSI_TX0_CLKN/LVDS_TX0_CLKN
MIPI_DSI_TX0_CLKP/LVDS_TX0_CLKP: U38.171(DSIO_C_P) ; off-sheet MIPI_DSI_TX0_CLKP/LVDS_TX0_CLKP
MIPI_DSI_TX0_D0N/LVDS_TX0_D0N: U38.157(DSIO_DO_N) ; off-sheet MIPI_DSI_TX0_D0N/LVDS_TX0_D0N
MIPI_DSI_TX0_D0P/LVDS_TX0_D0P: U38.159(DSIO_DO_P) ; off-sheet MIPI_DSI_TX0_D0P/LVDS_TX0_D0P
MIPI_DSI_TX0_D1N/LVDS_TX0_D1N: U38.163(DSIO_D1_N) ; off-sheet MIPI_DSI_TX0_D1N/LVDS_TX0_D1N
MIPI_DSI_TX0_D1P/LVDS_TX0_D1P: U38.165(DSIO_D1_P) ; off-sheet MIPI_DSI_TX0_D1P/LVDS_TX0_D1P
MIPI_DSI_TX1_CLKN: P8.1 U38.187(DSI1_C_N) ; off-sheet MIPI_DSI_TX1_CLKN
MIPI_DSI_TX1_CLKP: P9.1 U38.189(DSI1_C_P) ; off-sheet MIPI_DSI_TX1_CLKP
MIPI_DSI_TX1_D0N: P4.1 U38.175(DSI1_D0_N) ; off-sheet MIPI_DSI_TX1_D0N
MIPI_DSI_TX1_D0P: P5.1 U38.177(DSI1_D0_P) ; off-sheet MIPI_DSI_TX1_D0P
MIPI_DSI_TX1_D1N: P6.1 U38.181(DSI1_D1_N) ; off-sheet MIPI_DSI_TX1_D1N
MIPI_DSI_TX1_D1P: P7.1 U38.183(DSI1_D1_P) ; off-sheet MIPI_DSI_TX1_D1P
MIPI_DSI_TX1_D2N: P11.1 U38.193(DSI1_D2_N) ; off-sheet MIPI_DSI_TX1_D2N
MIPI_DSI_TX1_D2P: P13.1 U38.195(DSI1_D2_P) ; off-sheet MIPI_DSI_TX1_D2P
MIPI_DSI_TX1_D3N: P10.1 U38.194(DSI1_D3_N) ; off-sheet MIPI_DSI_TX1_D3N
MIPI_DSI_TX1_D3P: P12.1 U38.196(DSI1_D3_P) ; off-sheet MIPI_DSI_TX1_D3P
MIPI_TP_PWR: U38.109(Pcie_nRST) ; off-sheet MIPI_TP_PWR
PCIE20_CLKREQn_M2: U38.102(Pcie_CLK_nREQ) ; off-sheet PCIE20_CLKREQn_M2
PCIE20_REFCLKN: U38.112(Pcie_CLK_N) ; off-sheet PCIE20_REFCLKN
PCIE20_REFCLKP: U38.110(Pcie_CLK_P) ; off-sheet PCIE20_REFCLKP
PCIE20_RXN: U38.118(Pcie_RX_N) ; off-sheet PCIE20_RXN
PCIE20_RXP: U38.116(Pcie_RX_P) ; off-sheet PCIE20_RXP
PCIE20_TXN: U38.124(Pcie_TX_N) ; off-sheet PCIE20_TXN
PCIE20_TXP: U38.122(Pcie_TX_P) ; off-sheet PCIE20_TXP
USB_OTG0_DM: U38.103(USB2_N) ; off-sheet USB_OTG0_DM
USB_OTG0_DP: U38.105(USB2_P) ; off-sheet USB_OTG0_DP
USB_OTG0_ID: U38.101(USB_OTG_ID) ; off-sheet USB_OTG0_ID

Not connected (* = marked no-connect by the designer): U38 104(Reserved) 106(Reserved) 111(VDAC_COMP) 133(CAM1_D2_N) 135(CAM1_D2_P) 139(CAM1_D3_N) 141(CAM1_D3_P) 143(HDMI1_HOTPLUG) 145(HDMI1_SDA) 146(HDIM1_TX2_P) 147(HDMI1_SCL) 148(HDIM1_TX2_N) 149(HDMI1_CEC) 152(HDIM1_TX1_P) 154(HDIM1_TX1_N) 158(HDIM1_TX0_P) 160(HDIM1_TX0_N) 164(HDIM1_CLK_P) 166(HDIM1_CLK_N)

### Notes on the sheet
- (in symbol radxa_1010) Title:; Size; REV; Page Name:; Date:; Sheet; of

### Library data of the parts
P4-P13 = TESTPOINT1
U38 = HETER_4
*#20 = radxa_1010: Page Create Date: March  8, 1995